# Altium project q23-harness.PrjPcb (part 2 of 2)

## Sheet PDM.SchDoc: =DocumentName
size A4; Organization: Queen's Formula SAE; Address1: 130 Stuart St, Kingston; Address2: Ontario; Address3: Canada; Address4: K7L 2V9; DocumentNumber: 1; Revision: 0; SheetNumber: 1; SheetTotal: 1
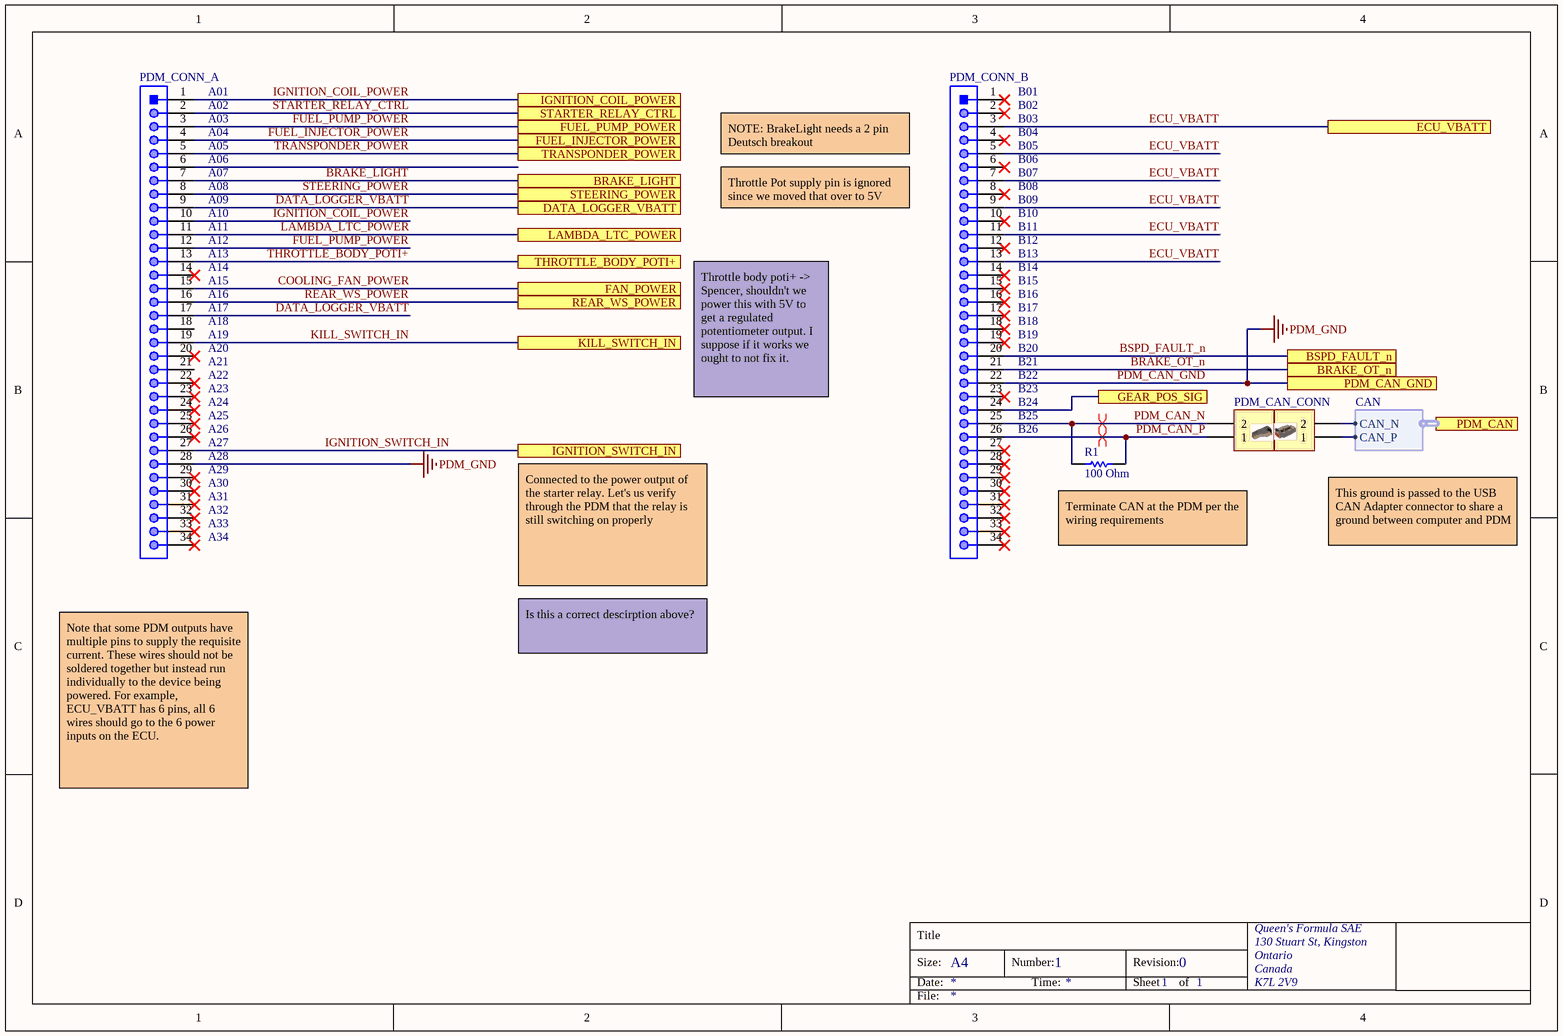
[diagram p6: PDM.SchDoc]

### Parts
(Parts that share a designator on the sheet are numbered #1, #2 ... from top to bottom, then left to right.)
PDM_CAN_CONN#1  Header 2  [HDR1X2]  (value not drawn)
PDM_CAN_CONN#2  Header 2  [HDR1X2]  (value not drawn)
PDM_CONN_A  61303411021  [61303411021]  (value not drawn)
PDM_CONN_B  61303411021  [61303411021]  (value not drawn)
R1  100 Ohm  [RESC3216X70X50NL05T20]

### Ports
BRAKE_LIGHT, BRAKE_OT_n, BSPD_FAULT_n, DATA_LOGGER_VBATT, ECU_VBATT, FAN_POWER, FUEL_INJECTOR_POWER, FUEL_PUMP_POWER, GEAR_POS_SIG, IGNITION_COIL_POWER, IGNITION_SWITCH_IN, KILL_SWITCH_IN, LAMBDA_LTC_POWER, PDM_CAN (harness CAN), PDM_CAN_GND, REAR_WS_POWER, STARTER_RELAY_CTRL, STEERING_POWER, THROTTLE_BODY_POTI+, TRANSPONDER_POWER

### Harnesses
CAN: CAN_P, CAN_N

### Nets
PDM_CAN_GND: PDM_CONN_A.28 PDM_CONN_B.22 ; port PDM_CAN_GND  [also labelled PDM_GND]  [project net FUEL_PRESSURE.SEN_0V]
BRAKE_LIGHT: PDM_CONN_A.7 ; port BRAKE_LIGHT
BRAKE_OT_n: PDM_CONN_B.21 ; port BRAKE_OT_n
BSPD_FAULT_n: PDM_CONN_B.20 ; port BSPD_FAULT_n
CAN.CAN_N: PDM_CAN_CONN#2.2 ; port PDM_CAN.CAN_N
CAN.CAN_P: PDM_CAN_CONN#2.1 ; port PDM_CAN.CAN_P
COOLING_FAN_POWER: PDM_CONN_A.15 ; port FAN_POWER
DATA_LOGGER_VBATT: PDM_CONN_A.9 PDM_CONN_A.17 ; port DATA_LOGGER_VBATT
ECU_VBATT: PDM_CONN_B.3 PDM_CONN_B.5 PDM_CONN_B.7 PDM_CONN_B.9 PDM_CONN_B.11 PDM_CONN_B.13 ; port ECU_VBATT
FUEL_INJECTOR_POWER: PDM_CONN_A.4 ; port FUEL_INJECTOR_POWER
FUEL_PUMP_POWER: PDM_CONN_A.3 PDM_CONN_A.12 ; port FUEL_PUMP_POWER
GEAR_POS_SIG: PDM_CONN_B.24 ; port GEAR_POS_SIG
IGNITION_COIL_POWER: PDM_CONN_A.1 PDM_CONN_A.10 ; port IGNITION_COIL_POWER
IGNITION_SWITCH_IN: PDM_CONN_A.27 ; port IGNITION_SWITCH_IN
KILL_SWITCH_IN: PDM_CONN_A.19 ; port KILL_SWITCH_IN
LAMBDA_LTC_POWER: PDM_CONN_A.11 ; port LAMBDA_LTC_POWER
PDM_CAN_N: PDM_CAN_CONN#1.2 PDM_CONN_B.25 R1.1
PDM_CAN_P: PDM_CAN_CONN#1.1 PDM_CONN_B.26 R1.2
REAR_WS_POWER: PDM_CONN_A.16 ; port REAR_WS_POWER
STARTER_RELAY_CTRL: PDM_CONN_A.2 ; port STARTER_RELAY_CTRL
STEERING_POWER: PDM_CONN_A.8 ; port STEERING_POWER
THROTTLE_BODY_POTI+: PDM_CONN_A.13 ; port THROTTLE_BODY_POTI+
TRANSPONDER_POWER: PDM_CONN_A.5 ; port TRANSPONDER_POWER

Not connected (* = marked no-connect by the designer): PDM_CONN_A 6 14* 18 20* 21 22* 23* 24* 25* 26* 29* 30* 31* 32* 33* 34*; PDM_CONN_B 1* 2* 4* 6* 8* 10* 12* 14* 15* 16* 17* 18* 19* 23* 27* 28* 29* 30* 31* 32* 33* 34*

### Layout directives
differential pair: PDM_CAN_N, PDM_CAN_P

### Notes on the sheet
- (near PDM_CONN_A) A01
- (near PDM_CONN_A) A02
- (near PDM_CONN_B) B01
- (near PDM_CONN_B) B02
- (near PDM_CONN_A) A03
- (near PDM_CONN_A) A04
- (near PDM_CONN_A) A05
- (near PDM_CONN_A) A06
- (near PDM_CONN_A) A07
- NOTE: BrakeLight needs a 2 pin Deutsch breakout
- (near PDM_CONN_B) B03
- (near PDM_CONN_B) B04
- (near PDM_CONN_B) B05
- (near PDM_CONN_B) B06
- (near PDM_CONN_B) B07
- (near PDM_CONN_A) A08
- (near PDM_CONN_A) A09
- (near PDM_CONN_A) A10
- (near PDM_CONN_A) A11
- (near PDM_CONN_A) A12
- Throttle Pot supply pin is ignored since we moved that over to 5V
- (near PDM_CONN_B) B08
- (near PDM_CONN_B) B09
- (near PDM_CONN_B) B10
- (near PDM_CONN_B) B11
- (near PDM_CONN_B) B12
- (near PDM_CONN_A) A13
- (near PDM_CONN_A) A14
- (near PDM_CONN_A) A15
- (near PDM_CONN_A) A16
- (near PDM_CONN_A) A17
- (near PDM_CONN_B) B13
- (near PDM_CONN_B) B14
- (near PDM_CONN_B) B15
- (near PDM_CONN_B) B16
- (near PDM_CONN_B) B17
- (near PDM_CONN_A) A18
- (near PDM_CONN_A) A19
- (near PDM_CONN_A) A20
- (near PDM_CONN_A) A21
- (near PDM_CONN_A) A22
- (near PDM_CONN_B) B18
- (near PDM_CONN_B) B19
- (near PDM_CONN_B) B20
- (near PDM_CONN_B) B21
- (near PDM_CONN_B) B22
- (near PDM_CONN_A) A23
- (near PDM_CONN_A) A24
- (near PDM_CONN_A) A25
- (near PDM_CONN_A) A26
- (near PDM_CONN_A) A27
- Throttle body poti+ -> Spencer, shouldn't we power this with 5V to get a regulated potentiometer output. I suppose if it works we ought to not fix it.
- (near PDM_CONN_B) B23
- (near PDM_CONN_B) B24
- B25
- B26
- (near PDM_CONN_A) A28
- (near PDM_CONN_A) A29
- (near PDM_CONN_A) A30
- (near PDM_CONN_A) A31
- (near PDM_CONN_A) A32
- (near PDM_CONN_A) A33
- (near PDM_CONN_A) A34
- Connected to the power output of the starter relay. Let's us verify through the PDM that the relay is still switching on properly
- (near R1) Terminate CAN at the PDM per the wiring requirements
- (near PDM_CAN_CONN#2) This ground is passed to the USB CAN Adapter connector to share a ground between computer and PDM
- Is this a correct descirption above?
- Note that some PDM outputs have multiple pins to supply the requisite current. These wires should not be soldered together but instead run individually to the device being powered. For example, ECU_VBATT has 6 pins, all 6 wires should go to the 6 power inputs on the ECU.
- Title
- Size:
- Date:
- A4
- Number:
- Time:
- Revision:
- Sheet
- of
- File:

### Library data of the parts
PDM_CAN_CONN#1 PDM_CAN_CONN#2 = Header 2: Header, 2-Pin; LatestRevisionDate: 17-Jul-2002; LatestRevisionNote: Re-released for DXP Platform.; Publisher: Altium Limited
PDM_CONN_A PDM_CONN_B = CMP-1502-01125-1: THT Angled Pin Header WR-PHD, Pitch 2.54 mm, Single Row, 34 pins; Manufacturer: Wurth Elektronik; Withstanding Voltage: 500VAC; Pin Number: 34; Rated Current: 3A; Gender: Male; Pitch: 2.54mm; Working Voltage: 250VAC; Contact Resistance: 20mOhm; Orientation: Angled; Mounting Technology: THT; Package Reference: 61303411021; Part Number: 61303411021; Datasheet URL: https://katalog.we-online.de/em/datasheet/6130xx11021.pdf; Publisher: WurthElektronik; Row Number: Single; Operating Temperature: -40to105degC; Packaging: Bag; Manufacturer URL: http://www.we-online.de
R1 = CMP-2003-00016-1: Manufacturer: Panasonic; Part Number: ERJ-8ENF1000V

## Sheet Data Logger.SchDoc: =DocumentName
size A4; Organization: Queen's Formula SAE; Address1: 130 Stuart St, Kingston; Address2: Ontario; Address3: Canada; Address4: K7L 2V9; DocumentNumber: 1; Revision: 0; SheetNumber: 1; SheetTotal: 1
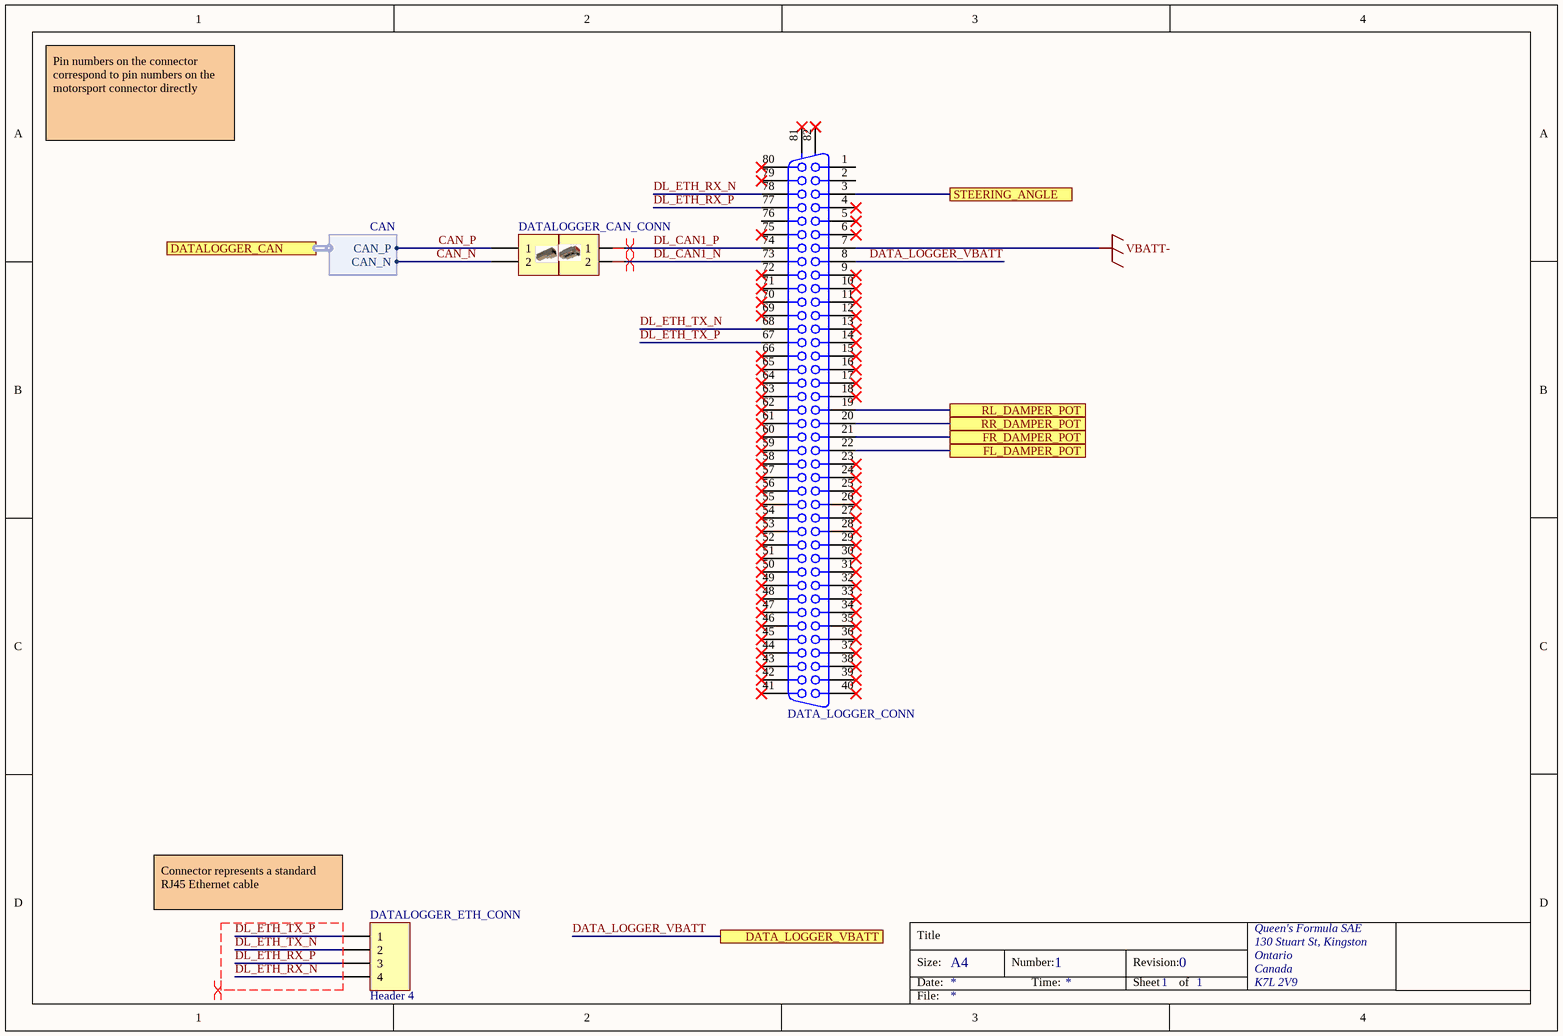
[diagram p7: Data Logger.SchDoc]

### Parts
DATA_LOGGER_CAN_CONN  Header 2  [HDR1X2]  (value not drawn)
DATA_LOGGER_CONN  Connector 80  [CHAMP1.27-2V80]  (value not drawn)
DATALOGGER_CAN_CONN  Header 2  [HDR1X2]  (value not drawn)
DATALOGGER_ETH_CONN  Header 4  [HDR1X4]

### Ports
DATA_LOGGER_VBATT, DATALOGGER_CAN (harness CAN), FL_DAMPER_POT, FR_DAMPER_POT, RL_DAMPER_POT, RR_DAMPER_POT, STEERING_ANGLE

### Harnesses
CAN: CAN_P, CAN_N

### Nets
VBATT-: DATA_LOGGER_CONN.7  [project net FUEL_PRESSURE.SEN_0V]
CAN_N: DATALOGGER_CAN_CONN.2 ; port DATALOGGER_CAN.CAN_N  [project net CAN.CAN_N]
CAN_P: DATALOGGER_CAN_CONN.1 ; port DATALOGGER_CAN.CAN_P  [project net CAN.CAN_P]
DATA_LOGGER_VBATT: DATA_LOGGER_CONN.8 ; port DATA_LOGGER_VBATT
DL_CAN1_N: DATA_LOGGER_CAN_CONN.2 DATA_LOGGER_CONN.73
DL_CAN1_P: DATA_LOGGER_CAN_CONN.1 DATA_LOGGER_CONN.74
DL_ETH_RX_N: DATA_LOGGER_CONN.78 DATALOGGER_ETH_CONN.4
DL_ETH_RX_P: DATA_LOGGER_CONN.77 DATALOGGER_ETH_CONN.3
DL_ETH_TX_N: DATA_LOGGER_CONN.68 DATALOGGER_ETH_CONN.2
DL_ETH_TX_P: DATA_LOGGER_CONN.67 DATALOGGER_ETH_CONN.1
FL_DAMPER_POT: DATA_LOGGER_CONN.22 ; port FL_DAMPER_POT
FR_DAMPER_POT: DATA_LOGGER_CONN.21 ; port FR_DAMPER_POT
RL_DAMPER_POT: DATA_LOGGER_CONN.19 ; port RL_DAMPER_POT
RR_DAMPER_POT: DATA_LOGGER_CONN.20 ; port RR_DAMPER_POT
STEERING_ANGLE: DATA_LOGGER_CONN.3 ; port STEERING_ANGLE

Not connected (* = marked no-connect by the designer): DATA_LOGGER_CONN 1 2 4* 5* 6* 9* 10* 11* 12* 13* 14* 15* 16* 17* 18* 23* 24* 25* 26* 27* 28* 29* 30* 31* 32* 33* 34* 35* 36* 37* 38* 39* 40* 41* 42* 43* 44* 45* 46* 47* 48* 49* 50* 51* 52* 53* 54* 55* 56* 57* 58* 59* 60* 61* 62* 63* 64* 65* 66* 69* 70* 71* 72* 75* 76 79* 80* 81(MH1)* 82(MH2)*

### Layout directives
differential pair: (no net found under the mark), DL_ETH_RX_N, DL_ETH_RX_P, DL_ETH_TX_N, DL_ETH_TX_P

### Notes on the sheet
- Pin numbers on the connector correspond to pin numbers on the motorsport connector directly
- (near DATALOGGER_ETH_CONN) Connector represents a standard RJ45 Ethernet cable
- Title
- Size:
- Date:
- A4
- Number:
- Time:
- Revision:
- Sheet
- of
- File:

### Library data of the parts
DATA_LOGGER_CAN_CONN DATALOGGER_CAN_CONN = Header 2: Header, 2-Pin; LatestRevisionDate: 17-Jul-2002; LatestRevisionNote: Re-released for DXP Platform.; Publisher: Altium Limited
DATA_LOGGER_CONN = Connector 80: Receptacle Header Assemby; PackageDocument: C; Positions: 80; Published: 15-Jun-2001; LatestRevisionDate: 17-Jul-2002; LatestRevisionNote: Re-released for DXP Platform.; DatasheetDocument: 1-Oct-1983; PackageReference: 917334; Publisher: Altium Limited; Orientation: Vertical
DATALOGGER_ETH_CONN = Header 4: Header, 4-Pin; LatestRevisionDate: 17-Jul-2002; LatestRevisionNote: Re-released for DXP Platform.; Publisher: Altium Limited

## Sheet REAR_LOOM_BULKHEAD.SchDoc: =DocumentName
size 420 x 297 mm; Organization: Queen's Formula SAE; Address1: 130 Stuart St, Kingston; Address2: Ontario; Address3: Canada; Address4: K7L 2V9; DocumentNumber: 1; Revision: 0; SheetNumber: 1; SheetTotal: 1
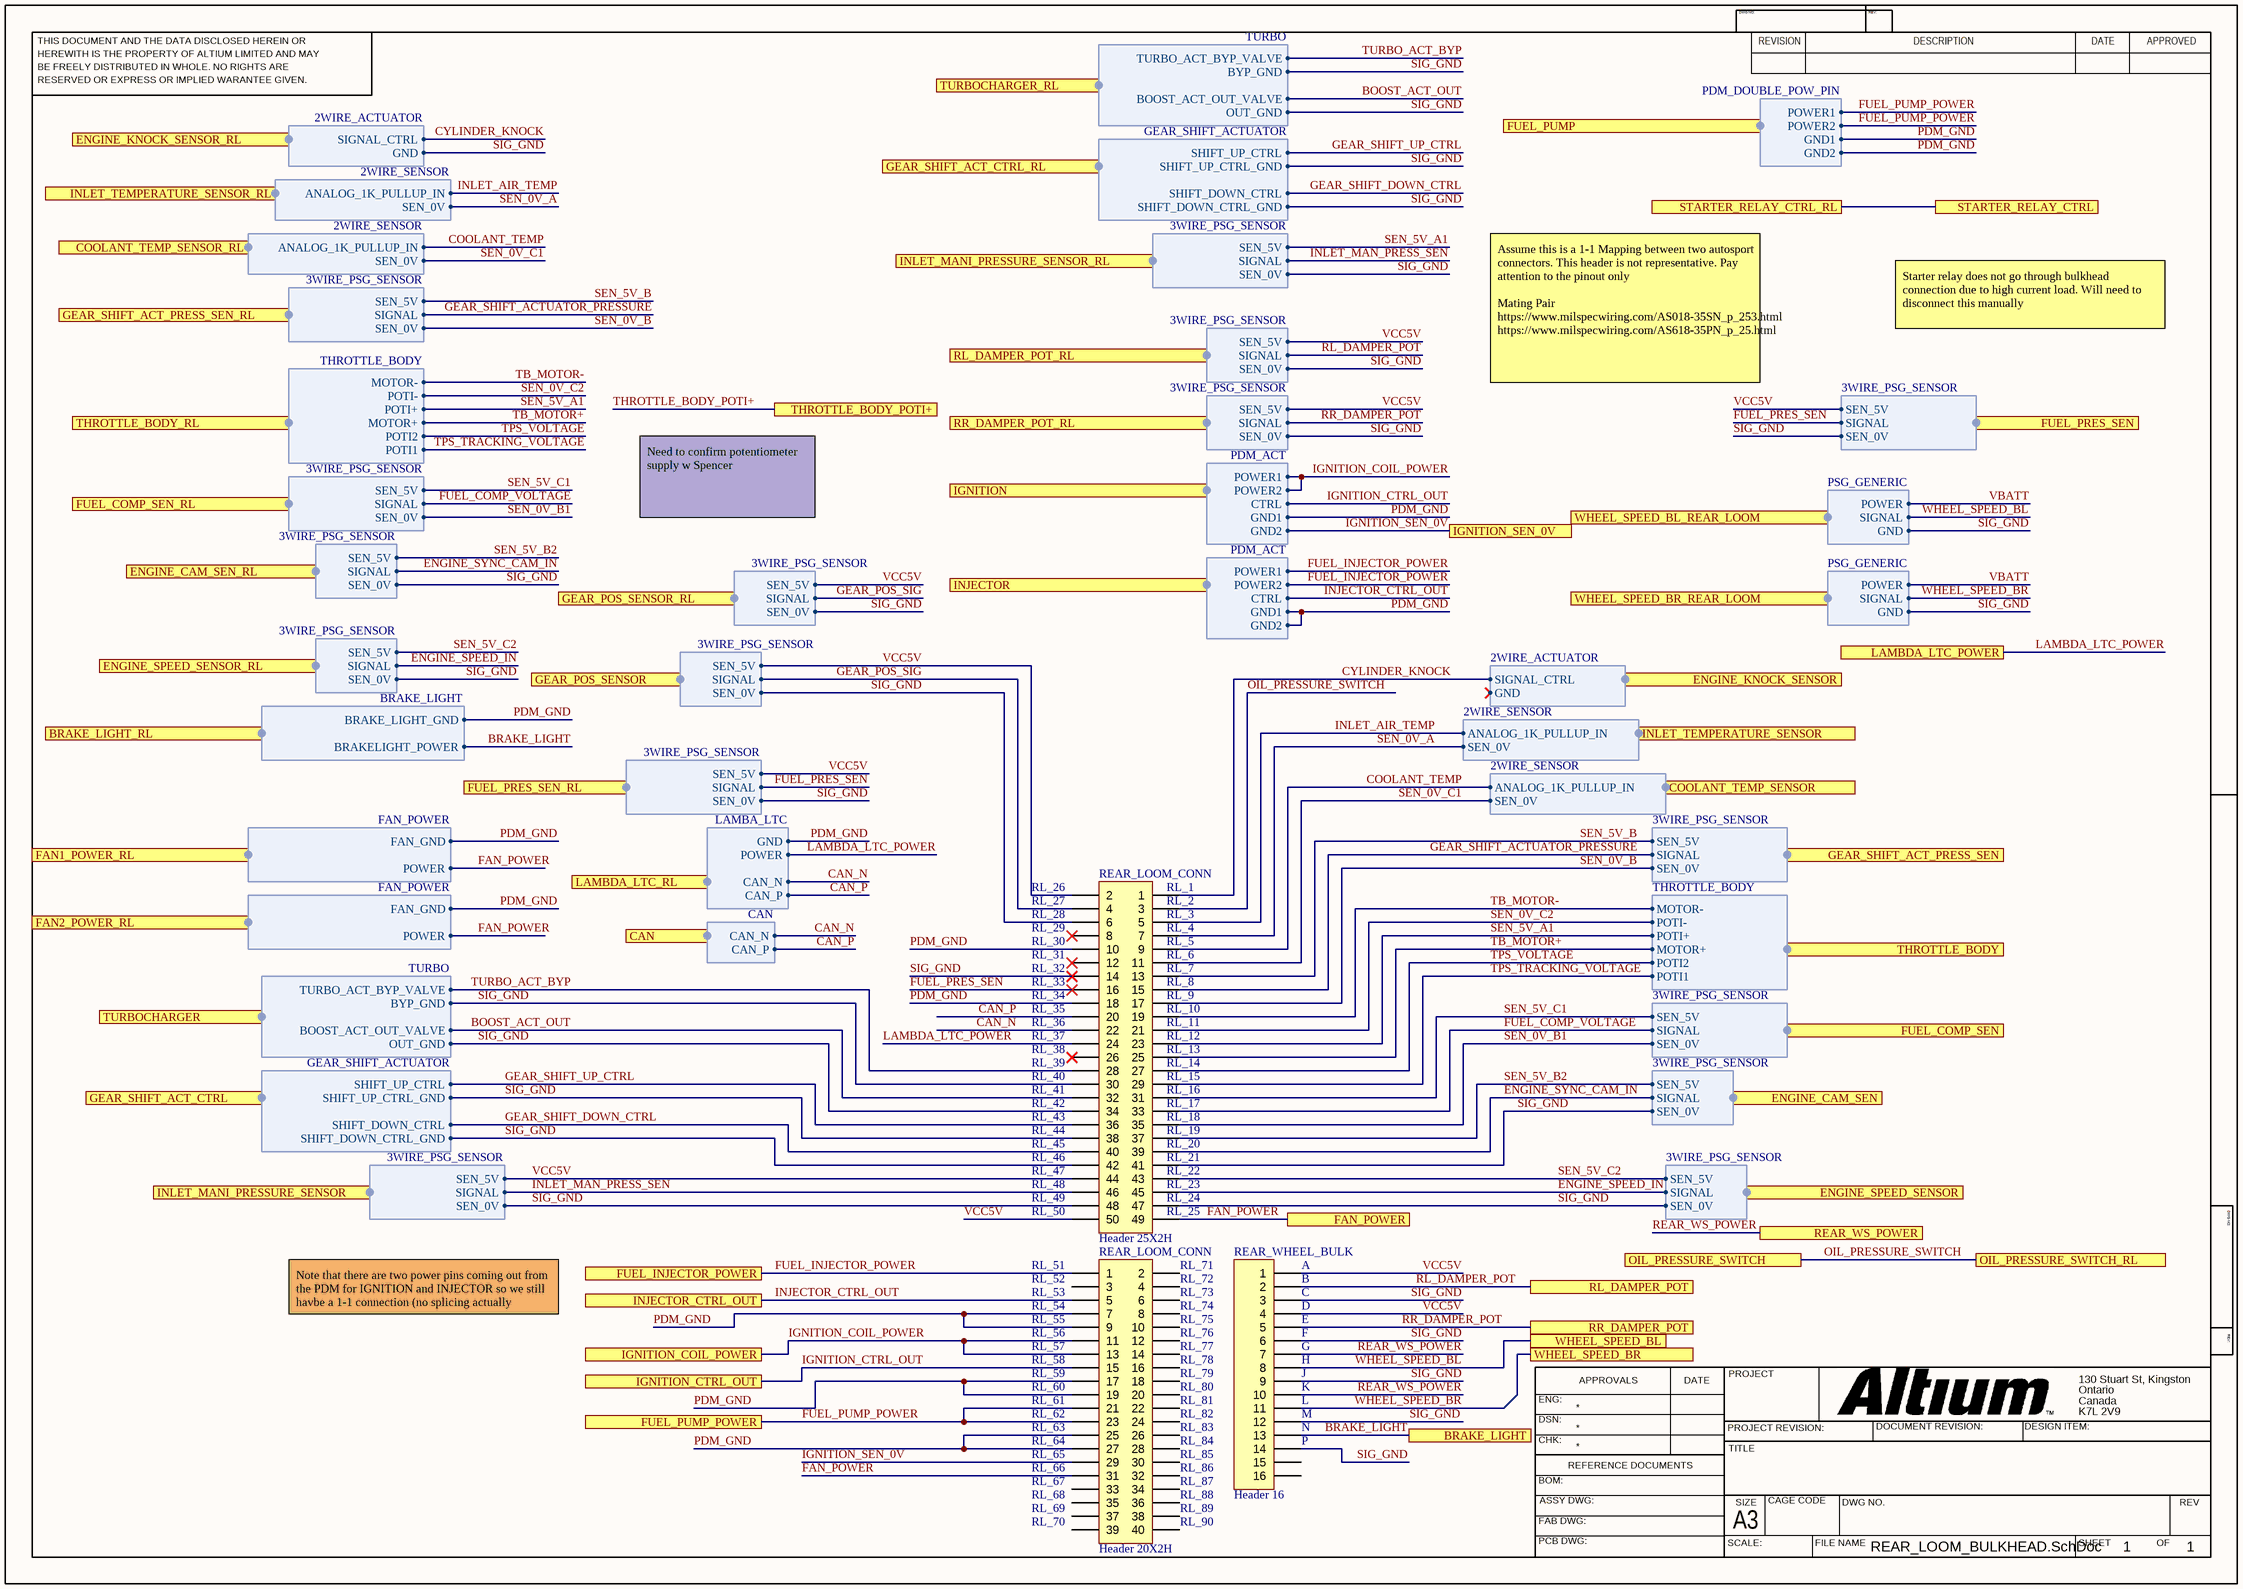
[diagram p8: REAR_LOOM_BULKHEAD.SchDoc]

### Parts
(Parts that share a designator on the sheet are numbered #1, #2 ... from top to bottom, then left to right.)
REAR_LOOM_CONN#1  Header 25X2H  [HDR2X25H]
REAR_LOOM_CONN#2  Header 20X2H  [HDR2X20H]
REAR_WHEEL_BULK  Header 16  [HDR1X16]

### Ports
BRAKE_LIGHT, BRAKE_LIGHT_RL (harness BRAKE_LIGHT), CAN (harness CAN), COOLANT_TEMP_SENSOR (harness 2WIRE_SENSOR), COOLANT_TEMP_SENSOR_RL (harness 2WIRE_SENSOR), ENGINE_CAM_SEN (harness 3WIRE_PSG_SENSOR), ENGINE_CAM_SEN_RL (harness 3WIRE_PSG_SENSOR), ENGINE_KNOCK_SENSOR (harness 2WIRE_ACTUATOR), ENGINE_KNOCK_SENSOR_RL (harness 2WIRE_ACTUATOR), ENGINE_SPEED_SENSOR (harness 3WIRE_PSG_SENSOR), ENGINE_SPEED_SENSOR_RL (harness 3WIRE_PSG_SENSOR), FAN1_POWER_RL (harness FAN_POWER), FAN2_POWER_RL (harness FAN_POWER), FAN_POWER, FUEL_COMP_SEN (harness 3WIRE_PSG_SENSOR), FUEL_COMP_SEN_RL (harness 3WIRE_PSG_SENSOR), FUEL_INJECTOR_POWER, FUEL_PRES_SEN (harness 3WIRE_PSG_SENSOR), FUEL_PRES_SEN_RL (harness 3WIRE_PSG_SENSOR), FUEL_PUMP (harness PDM_DOUBLE_POW_PIN), FUEL_PUMP_POWER, GEAR_POS_SENSOR (harness 3WIRE_PSG_SENSOR), GEAR_POS_SENSOR_RL (harness 3WIRE_PSG_SENSOR), GEAR_SHIFT_ACT_CTRL (harness GEAR_SHIFT_ACTUATOR), GEAR_SHIFT_ACT_CTRL_RL (harness GEAR_SHIFT_ACTUATOR), GEAR_SHIFT_ACT_PRESS_SEN (harness 3WIRE_PSG_SENSOR), GEAR_SHIFT_ACT_PRESS_SEN_RL (harness 3WIRE_PSG_SENSOR), IGNITION (harness PDM_ACT), IGNITION_COIL_POWER, IGNITION_CTRL_OUT, IGNITION_SEN_0V, INJECTOR (harness PDM_ACT), INJECTOR_CTRL_OUT, INLET_MANI_PRESSURE_SENSOR (harness 3WIRE_PSG_SENSOR), INLET_MANI_PRESSURE_SENSOR_RL (harness 3WIRE_PSG_SENSOR), INLET_TEMPERATURE_SENSOR (harness 2WIRE_SENSOR), INLET_TEMPERATURE_SENSOR_RL (harness 2WIRE_SENSOR), LAMBDA_LTC_POWER, LAMBDA_LTC_RL (harness LAMBA_LTC), OIL_PRESSURE_SWITCH, OIL_PRESSURE_SWITCH_RL, REAR_WS_POWER, RL_DAMPER_POT, RL_DAMPER_POT_RL (harness 3WIRE_PSG_SENSOR), RR_DAMPER_POT, RR_DAMPER_POT_RL (harness 3WIRE_PSG_SENSOR), STARTER_RELAY_CTRL, STARTER_RELAY_CTRL_RL, THROTTLE_BODY (harness THROTTLE_BODY), THROTTLE_BODY_POTI+, THROTTLE_BODY_RL (harness THROTTLE_BODY), TURBOCHARGER (harness TURBO), TURBOCHARGER_RL (harness TURBO), WHEEL_SPEED_BL, WHEEL_SPEED_BL_REAR_LOOM (harness PSG_GENERIC), WHEEL_SPEED_BR, WHEEL_SPEED_BR_REAR_LOOM (harness PSG_GENERIC)

### Harnesses
2WIRE_ACTUATOR: SIGNAL_CTRL, GND
GEAR_SHIFT_ACTUATOR: SHIFT_UP_CTRL, SHIFT_DOWN_CTRL, SHIFT_UP_CTRL_GND, SHIFT_DOWN_CTRL_GND
3WIRE_PSG_SENSOR: SEN_5V, SEN_0V, SIGNAL
TURBO: TURBO_ACT_BYP_VALVE, BOOST_ACT_OUT_VALVE, BYP_GND, OUT_GND
2WIRE_SENSOR: ANALOG_1K_PULLUP_IN, SEN_0V
THROTTLE_BODY: MOTOR+, MOTOR-, POTI1, POTI2, POTI-, POTI+
BRAKE_LIGHT: BRAKELIGHT_POWER, BRAKE_LIGHT_GND
PDM_ACT: POWER1, CTRL, GND1, GND2, POWER2
PDM_DOUBLE_POW_PIN: POWER1, GND1, GND2, POWER2
PSG_GENERIC: POWER, GND, SIGNAL
FAN_POWER: POWER, FAN_GND
CAN: CAN_P, CAN_N
LAMBA_LTC: CAN_P, CAN_N, POWER, GND

### Nets
SEN_5V_A1: REAR_LOOM_CONN#1.2 REAR_LOOM_CONN#1.23 REAR_LOOM_CONN#1.44 REAR_LOOM_CONN#1.50 REAR_WHEEL_BULK.1 REAR_WHEEL_BULK.4 ; port INLET_MANI_PRESSURE_SENSOR.SEN_5V, port THROTTLE_BODY.POTI+, port THROTTLE_BODY_RL.POTI+, port INLET_MANI_PRESSURE_SENSOR_RL.SEN_5V, port RL_DAMPER_POT_RL.SEN_5V, port RR_DAMPER_POT_RL.SEN_5V, port GEAR_POS_SENSOR.SEN_5V, port GEAR_POS_SENSOR_RL.SEN_5V, port FUEL_PRES_SEN.SEN_5V, port FUEL_PRES_SEN_RL.SEN_5V  [also labelled VCC5V]  [project net FUEL_PRESSURE.SEN_5V]
SIG_GND: REAR_LOOM_CONN#1.6 REAR_LOOM_CONN#1.14 REAR_LOOM_CONN#1.30 REAR_LOOM_CONN#1.34 REAR_LOOM_CONN#1.38 REAR_LOOM_CONN#1.41 REAR_LOOM_CONN#1.42 REAR_LOOM_CONN#1.47 REAR_LOOM_CONN#1.48 REAR_WHEEL_BULK.3 REAR_WHEEL_BULK.6 REAR_WHEEL_BULK.9 REAR_WHEEL_BULK.12 REAR_WHEEL_BULK.14 ; port ENGINE_KNOCK_SENSOR.GND, port GEAR_SHIFT_ACT_CTRL.SHIFT_UP_CTRL_GND, port GEAR_SHIFT_ACT_CTRL.SHIFT_DOWN_CTRL_GND, port ENGINE_SPEED_SENSOR.SEN_0V, port ENGINE_CAM_SEN.SEN_0V, port INLET_MANI_PRESSURE_SENSOR.SEN_0V, port TURBOCHARGER.BYP_GND, port TURBOCHARGER.OUT_GND, port ENGINE_KNOCK_SENSOR_RL.GND, port ENGINE_SPEED_SENSOR_RL.SEN_0V, port ENGINE_CAM_SEN_RL.SEN_0V, port GEAR_SHIFT_ACT_CTRL_RL.SHIFT_UP_CTRL_GND, port GEAR_SHIFT_ACT_CTRL_RL.SHIFT_DOWN_CTRL_GND, port INLET_MANI_PRESSURE_SENSOR_RL.SEN_0V, port TURBOCHARGER_RL.BYP_GND, port TURBOCHARGER_RL.OUT_GND, port RL_DAMPER_POT_RL.SEN_0V, port RR_DAMPER_POT_RL.SEN_0V, port WHEEL_SPEED_BL_REAR_LOOM.GND, port WHEEL_SPEED_BR_REAR_LOOM.GND, port GEAR_POS_SENSOR.SEN_0V, port GEAR_POS_SENSOR_RL.SEN_0V, port FUEL_PRES_SEN.SEN_0V, port FUEL_PRES_SEN_RL.SEN_0V  [project net FUEL_PRESSURE.SEN_0V]
BOOST_ACT_OUT: REAR_LOOM_CONN#1.32 ; port TURBOCHARGER.BOOST_ACT_OUT_VALVE, port TURBOCHARGER_RL.BOOST_ACT_OUT_VALVE
BRAKE_LIGHT: REAR_WHEEL_BULK.13 ; port BRAKE_LIGHT, port BRAKE_LIGHT_RL.BRAKELIGHT_POWER
CAN_N: REAR_LOOM_CONN#1.22 ; port CAN.CAN_N, port LAMBDA_LTC_RL.CAN_N  [project net CAN.CAN_N]
CAN_P: REAR_LOOM_CONN#1.20 ; port CAN.CAN_P, port LAMBDA_LTC_RL.CAN_P  [project net CAN.CAN_P]
COOLANT_TEMP: REAR_LOOM_CONN#1.9 ; port COOLANT_TEMP_SENSOR.ANALOG_1K_PULLUP_IN, port COOLANT_TEMP_SENSOR_RL.ANALOG_1K_PULLUP_IN
CYLINDER_KNOCK: REAR_LOOM_CONN#1.1 ; port ENGINE_KNOCK_SENSOR.SIGNAL_CTRL, port ENGINE_KNOCK_SENSOR_RL.SIGNAL_CTRL
ENGINE_SPEED_IN: REAR_LOOM_CONN#1.45 ; port ENGINE_SPEED_SENSOR.SIGNAL, port ENGINE_SPEED_SENSOR_RL.SIGNAL
ENGINE_SYNC_CAM_IN: REAR_LOOM_CONN#1.39 ; port ENGINE_CAM_SEN.SIGNAL, port ENGINE_CAM_SEN_RL.SIGNAL
FAN_POWER: REAR_LOOM_CONN#1.49 REAR_LOOM_CONN#2.31 ; port FAN_POWER, port FAN1_POWER_RL.POWER, port FAN2_POWER_RL.POWER  [project net COOLING_FAN_POWER]
FUEL_COMP_VOLTAGE: REAR_LOOM_CONN#1.33 ; port FUEL_COMP_SEN.SIGNAL, port FUEL_COMP_SEN_RL.SIGNAL
FUEL_INJECTOR_POWER: REAR_LOOM_CONN#2.1 ; port FUEL_INJECTOR_POWER, port INJECTOR.POWER1, port INJECTOR.POWER2
FUEL_PRES_SEN: REAR_LOOM_CONN#1.16 ; port FUEL_PRES_SEN.SIGNAL, port FUEL_PRES_SEN_RL.SIGNAL
FUEL_PUMP_POWER: REAR_LOOM_CONN#2.21 REAR_LOOM_CONN#2.23 ; port FUEL_PUMP_POWER, port FUEL_PUMP.POWER1, port FUEL_PUMP.POWER2
GEAR_POS_SIG: REAR_LOOM_CONN#1.4 ; port GEAR_POS_SENSOR.SIGNAL, port GEAR_POS_SENSOR_RL.SIGNAL
GEAR_SHIFT_ACTUATOR_PRESSURE: REAR_LOOM_CONN#1.15 ; port GEAR_SHIFT_ACT_PRESS_SEN.SIGNAL, port GEAR_SHIFT_ACT_PRESS_SEN_RL.SIGNAL
GEAR_SHIFT_DOWN_CTRL: REAR_LOOM_CONN#1.40 ; port GEAR_SHIFT_ACT_CTRL.SHIFT_DOWN_CTRL, port GEAR_SHIFT_ACT_CTRL_RL.SHIFT_DOWN_CTRL
GEAR_SHIFT_UP_CTRL: REAR_LOOM_CONN#1.36 ; port GEAR_SHIFT_ACT_CTRL.SHIFT_UP_CTRL, port GEAR_SHIFT_ACT_CTRL_RL.SHIFT_UP_CTRL
IGNITION_COIL_POWER: REAR_LOOM_CONN#2.11 REAR_LOOM_CONN#2.13 ; port IGNITION_COIL_POWER, port IGNITION.POWER1, port IGNITION.POWER2
IGNITION_CTRL_OUT: REAR_LOOM_CONN#2.15 ; port IGNITION_CTRL_OUT, port IGNITION.CTRL
IGNITION_SEN_0V: REAR_LOOM_CONN#1.17 REAR_LOOM_CONN#2.29 ; port IGNITION_SEN_0V, port GEAR_SHIFT_ACT_PRESS_SEN.SEN_0V, port GEAR_SHIFT_ACT_PRESS_SEN_RL.SEN_0V, port IGNITION.GND2  [also labelled SEN_0V_B]
INJECTOR_CTRL_OUT: REAR_LOOM_CONN#2.5 ; port INJECTOR_CTRL_OUT, port INJECTOR.CTRL
INLET_AIR_TEMP: REAR_LOOM_CONN#1.5 ; port INLET_TEMPERATURE_SENSOR.ANALOG_1K_PULLUP_IN, port INLET_TEMPERATURE_SENSOR_RL.ANALOG_1K_PULLUP_IN
INLET_MAN_PRESS_SEN: REAR_LOOM_CONN#1.46 ; port INLET_MANI_PRESSURE_SENSOR.SIGNAL, port INLET_MANI_PRESSURE_SENSOR_RL.SIGNAL
LAMBDA_LTC_POWER: REAR_LOOM_CONN#1.24 ; port LAMBDA_LTC_POWER, port LAMBDA_LTC_RL.POWER
OIL_PRESSURE_SWITCH: REAR_LOOM_CONN#1.3 ; port OIL_PRESSURE_SWITCH, port OIL_PRESSURE_SWITCH_RL
PDM_GND: REAR_LOOM_CONN#1.10 REAR_LOOM_CONN#1.18 REAR_LOOM_CONN#2.7 REAR_LOOM_CONN#2.9 REAR_LOOM_CONN#2.17 REAR_LOOM_CONN#2.19 REAR_LOOM_CONN#2.25 REAR_LOOM_CONN#2.27 ; port BRAKE_LIGHT_RL.BRAKE_LIGHT_GND, port INJECTOR.GND1, port INJECTOR.GND2, port IGNITION.GND1, port FUEL_PUMP.GND1, port FUEL_PUMP.GND2, port FAN1_POWER_RL.FAN_GND, port FAN2_POWER_RL.FAN_GND, port LAMBDA_LTC_RL.GND
REAR_WS_POWER: REAR_WHEEL_BULK.7 REAR_WHEEL_BULK.10 ; port REAR_WS_POWER
RL_DAMPER_POT: REAR_WHEEL_BULK.2 ; port RL_DAMPER_POT, port RL_DAMPER_POT_RL.SIGNAL
RR_DAMPER_POT: REAR_WHEEL_BULK.5 ; port RR_DAMPER_POT, port RR_DAMPER_POT_RL.SIGNAL
SEN_0V_A: REAR_LOOM_CONN#1.7 ; port INLET_TEMPERATURE_SENSOR.SEN_0V, port INLET_TEMPERATURE_SENSOR_RL.SEN_0V
SEN_0V_B1: REAR_LOOM_CONN#1.35 ; port FUEL_COMP_SEN.SEN_0V, port FUEL_COMP_SEN_RL.SEN_0V
SEN_0V_C1: REAR_LOOM_CONN#1.11 ; port COOLANT_TEMP_SENSOR.SEN_0V, port COOLANT_TEMP_SENSOR_RL.SEN_0V
SEN_0V_C2: REAR_LOOM_CONN#1.21 ; port THROTTLE_BODY.POTI-, port THROTTLE_BODY_RL.POTI-
SEN_5V_B: REAR_LOOM_CONN#1.13 ; port GEAR_SHIFT_ACT_PRESS_SEN.SEN_5V, port GEAR_SHIFT_ACT_PRESS_SEN_RL.SEN_5V
SEN_5V_B2: REAR_LOOM_CONN#1.37 ; port ENGINE_CAM_SEN.SEN_5V, port ENGINE_CAM_SEN_RL.SEN_5V
SEN_5V_C1: REAR_LOOM_CONN#1.31 ; port FUEL_COMP_SEN.SEN_5V, port FUEL_COMP_SEN_RL.SEN_5V
SEN_5V_C2: REAR_LOOM_CONN#1.43 ; port ENGINE_SPEED_SENSOR.SEN_5V, port ENGINE_SPEED_SENSOR_RL.SEN_5V
STARTER_RELAY_CTRL: port STARTER_RELAY_CTRL, port STARTER_RELAY_CTRL_RL
TB_MOTOR+: REAR_LOOM_CONN#1.25 ; port THROTTLE_BODY.MOTOR+, port THROTTLE_BODY_RL.MOTOR+
TB_MOTOR-: REAR_LOOM_CONN#1.19 ; port THROTTLE_BODY.MOTOR-, port THROTTLE_BODY_RL.MOTOR-
TPS_TRACKING_VOLTAGE: REAR_LOOM_CONN#1.29 ; port THROTTLE_BODY.POTI1, port THROTTLE_BODY_RL.POTI1
TPS_VOLTAGE: REAR_LOOM_CONN#1.27 ; port THROTTLE_BODY.POTI2, port THROTTLE_BODY_RL.POTI2
TURBO_ACT_BYP: REAR_LOOM_CONN#1.28 ; port TURBOCHARGER.TURBO_ACT_BYP_VALVE, port TURBOCHARGER_RL.TURBO_ACT_BYP_VALVE
VBATT: port WHEEL_SPEED_BL_REAR_LOOM.POWER, port WHEEL_SPEED_BR_REAR_LOOM.POWER
WHEEL_SPEED_BL: REAR_WHEEL_BULK.8 ; port WHEEL_SPEED_BL, port WHEEL_SPEED_BL_REAR_LOOM.SIGNAL
WHEEL_SPEED_BR: REAR_WHEEL_BULK.11 ; port WHEEL_SPEED_BR, port WHEEL_SPEED_BR_REAR_LOOM.SIGNAL

Not connected (* = marked no-connect by the designer): REAR_LOOM_CONN#1 8* 12* 26*; REAR_LOOM_CONN#2 2 3 4 6 8 10 12 14 16 18 20 22 24 26 28 30 32 33 34 35 36 37 38 39 40; REAR_WHEEL_BULK 15 16

### Notes on the sheet
- Starter relay does not go through bulkhead connection due to high current load. Will need to disconnect this manually
- Assume this is a 1-1 Mapping between two autosport connectors. This header is not representative. Pay attention to the pinout only
  Mating Pair
  https://www.milspecwiring.com/AS018-35SN_p_253.html
  https://www.milspecwiring.com/AS618-35PN_p_25.html
- Need to confirm potentiometer supply w Spencer
- (near REAR_LOOM_CONN#1) RL_26
- (near REAR_LOOM_CONN#1) RL_27
- (near REAR_LOOM_CONN#1) RL_28
- (near REAR_LOOM_CONN#1) RL_29
- (near REAR_LOOM_CONN#1) RL_1
- (near REAR_LOOM_CONN#1) RL_2
- (near REAR_LOOM_CONN#1) RL_3
- (near REAR_LOOM_CONN#1) RL_4
- (near REAR_LOOM_CONN#1) RL_30
- (near REAR_LOOM_CONN#1) RL_31
- (near REAR_LOOM_CONN#1) RL_32
- (near REAR_LOOM_CONN#1) RL_33
- (near REAR_LOOM_CONN#1) RL_34
- (near REAR_LOOM_CONN#1) RL_5
- (near REAR_LOOM_CONN#1) RL_6
- (near REAR_LOOM_CONN#1) RL_7
- (near REAR_LOOM_CONN#1) RL_8
- (near REAR_LOOM_CONN#1) RL_9
- (near REAR_LOOM_CONN#1) RL_35
- (near REAR_LOOM_CONN#1) RL_36
- (near REAR_LOOM_CONN#1) RL_37
- (near REAR_LOOM_CONN#1) RL_38
- (near REAR_LOOM_CONN#1) RL_39
- (near REAR_LOOM_CONN#1) RL_10
- (near REAR_LOOM_CONN#1) RL_11
- (near REAR_LOOM_CONN#1) RL_12
- (near REAR_LOOM_CONN#1) RL_13
- (near REAR_LOOM_CONN#1) RL_14
- (near REAR_LOOM_CONN#1) RL_40
- (near REAR_LOOM_CONN#1) RL_41
- (near REAR_LOOM_CONN#1) RL_42
- (near REAR_LOOM_CONN#1) RL_43
- (near REAR_LOOM_CONN#1) RL_44
- (near REAR_LOOM_CONN#1) RL_15
- (near REAR_LOOM_CONN#1) RL_16
- (near REAR_LOOM_CONN#1) RL_17
- (near REAR_LOOM_CONN#1) RL_18
- (near REAR_LOOM_CONN#1) RL_19
- (near REAR_LOOM_CONN#1) RL_45
- (near REAR_LOOM_CONN#1) RL_46
- (near REAR_LOOM_CONN#1) RL_47
- (near REAR_LOOM_CONN#1) RL_48
- (near REAR_LOOM_CONN#1) RL_49
- (near REAR_LOOM_CONN#1) RL_20
- (near REAR_LOOM_CONN#1) RL_21
- (near REAR_LOOM_CONN#1) RL_22
- (near REAR_LOOM_CONN#1) RL_23
- (near REAR_LOOM_CONN#1) RL_24
- (near REAR_LOOM_CONN#1) RL_50
- (near REAR_LOOM_CONN#2) RL_51
- (near REAR_LOOM_CONN#1) RL_25
- (near REAR_LOOM_CONN#2) RL_71
- (near REAR_WHEEL_BULK) A
- Note that there are two power pins coming out from the PDM for IGNITION and INJECTOR so we still havbe a 1-1 connection (no splicing actually needed)
- (near REAR_LOOM_CONN#2) RL_52
- (near REAR_LOOM_CONN#2) RL_53
- (near REAR_LOOM_CONN#2) RL_54
- (near REAR_LOOM_CONN#2) RL_55
- (near REAR_LOOM_CONN#2) RL_56
- (near REAR_LOOM_CONN#2) RL_72
- (near REAR_LOOM_CONN#2) RL_73
- (near REAR_LOOM_CONN#2) RL_74
- (near REAR_LOOM_CONN#2) RL_75
- (near REAR_LOOM_CONN#2) RL_76
- (near REAR_WHEEL_BULK) B
- (near REAR_WHEEL_BULK) C
- (near REAR_WHEEL_BULK) D
- (near REAR_WHEEL_BULK) E
- (near REAR_WHEEL_BULK) F
- (near REAR_LOOM_CONN#2) RL_57
- (near REAR_LOOM_CONN#2) RL_58
- (near REAR_LOOM_CONN#2) RL_59
- (near REAR_LOOM_CONN#2) RL_60
- (near REAR_LOOM_CONN#2) RL_61
- (near REAR_LOOM_CONN#2) RL_77
- (near REAR_LOOM_CONN#2) RL_78
- (near REAR_LOOM_CONN#2) RL_79
- (near REAR_LOOM_CONN#2) RL_80
- (near REAR_LOOM_CONN#2) RL_81
- (near REAR_WHEEL_BULK) G
- (near REAR_WHEEL_BULK) H
- (near REAR_WHEEL_BULK) J
- (near REAR_WHEEL_BULK) K
- (near REAR_WHEEL_BULK) L
- (near REAR_LOOM_CONN#2) RL_62
- (near REAR_LOOM_CONN#2) RL_63
- (near REAR_LOOM_CONN#2) RL_64
- (near REAR_LOOM_CONN#2) RL_65
- (near REAR_LOOM_CONN#2) RL_66
- (near REAR_LOOM_CONN#2) RL_82
- (near REAR_LOOM_CONN#2) RL_83
- (near REAR_LOOM_CONN#2) RL_84
- (near REAR_LOOM_CONN#2) RL_85
- (near REAR_LOOM_CONN#2) RL_86
- (near REAR_WHEEL_BULK) M
- (near REAR_WHEEL_BULK) N
- (near REAR_WHEEL_BULK) P
- (near REAR_LOOM_CONN#2) RL_67
- (near REAR_LOOM_CONN#2) RL_68
- (near REAR_LOOM_CONN#2) RL_69
- (near REAR_LOOM_CONN#2) RL_70
- (near REAR_LOOM_CONN#2) RL_87
- (near REAR_LOOM_CONN#2) RL_88
- (near REAR_LOOM_CONN#2) RL_89
- (near REAR_LOOM_CONN#2) RL_90
- THIS DOCUMENT AND THE DATA DISCLOSED HEREIN OR
- HEREWITH IS THE PROPERTY OF ALTIUM LIMITED AND MAY
- DWG NO:
- REVISION
- REV:
- DESCRIPTION
- DATE
- APPROVED
- BE FREELY DISTRIBUTED IN WHOLE. NO RIGHTS ARE
- RESERVED OR EXPRESS OR IMPLIED WARANTEE GIVEN.
- ENG:
- APPROVALS
- PROJECT
- DSN:
- CHK:
- REFERENCE DOCUMENTS
- PROJECT REVISION:
- TITLE
- DOCUMENT REVISION:
- DESIGN ITEM:
- BOM:
- FAB DWG:
- PCB DWG:
- ASSY DWG:
- SCALE:
- A3
- SIZE
- CAGE CODE
- FILE NAME
- DWG NO.
- SHEET
- OF
- REV

### Library data of the parts
REAR_LOOM_CONN#1 = Header 25X2H: Header, 25-Pin, Dual row, Right Angle; LatestRevisionDate: 17-Jul-2002; LatestRevisionNote: Re-released for DXP Platform.; Publisher: Altium Limited
REAR_LOOM_CONN#2 = Header 20X2H: Header, 20-Pin, Dual row, Right Angle; LatestRevisionDate: 17-Jul-2002; LatestRevisionNote: Re-released for DXP Platform.; Publisher: Altium Limited
REAR_WHEEL_BULK = Header 16: Header, 16-Pin; LatestRevisionDate: 17-Jul-2002; LatestRevisionNote: Re-released for DXP Platform.; Publisher: Altium Limited

## Sheet PEDALBOX_BULKHEAD.SchDoc: =DocumentName
size A4; Organization: Queen's Formula SAE; Address1: 130 Stuart St, Kingston; Address2: Ontario; Address3: Canada; Address4: K7L 2V9; DocumentNumber: 1; Revision: 0; SheetNumber: 1; SheetTotal: 1
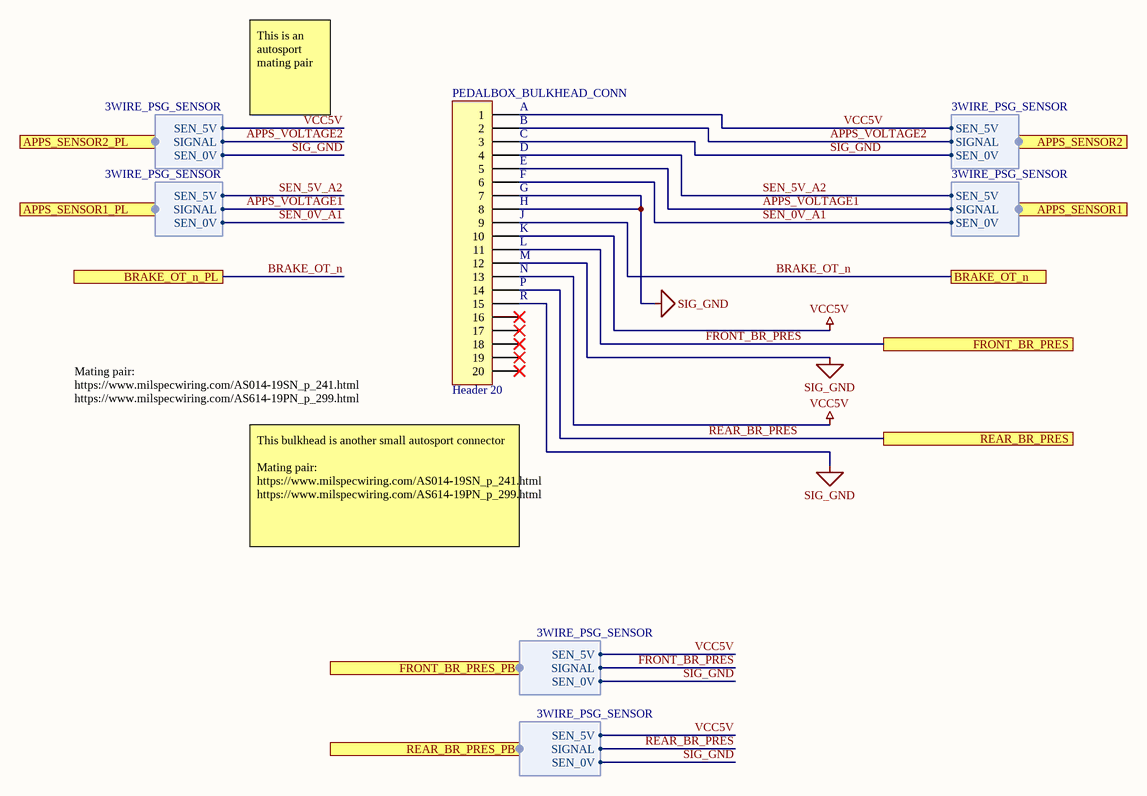
[diagram p9: PEDALBOX_BULKHEAD.SchDoc]

### Parts
PEDALBOX_BULKHEAD_CONN  Header 20  [HDR1X20]

### Ports
APPS_SENSOR1 (harness 3WIRE_PSG_SENSOR), APPS_SENSOR1_PL (harness 3WIRE_PSG_SENSOR), APPS_SENSOR2 (harness 3WIRE_PSG_SENSOR), APPS_SENSOR2_PL (harness 3WIRE_PSG_SENSOR), BRAKE_OT_n, BRAKE_OT_n_PL, FRONT_BR_PRES, FRONT_BR_PRES_PB (harness 3WIRE_PSG_SENSOR), REAR_BR_PRES, REAR_BR_PRES_PB (harness 3WIRE_PSG_SENSOR)

### Harnesses
3WIRE_PSG_SENSOR: SEN_5V, SEN_0V, SIGNAL

### Nets
SIG_GND: PEDALBOX_BULKHEAD_CONN.3 PEDALBOX_BULKHEAD_CONN.7 PEDALBOX_BULKHEAD_CONN.8 PEDALBOX_BULKHEAD_CONN.12 PEDALBOX_BULKHEAD_CONN.15 ; port APPS_SENSOR2.SEN_0V, port APPS_SENSOR2_PL.SEN_0V, port FRONT_BR_PRES_PB.SEN_0V, port REAR_BR_PRES_PB.SEN_0V  [project net FUEL_PRESSURE.SEN_0V]
VCC5V: PEDALBOX_BULKHEAD_CONN.1 PEDALBOX_BULKHEAD_CONN.10 PEDALBOX_BULKHEAD_CONN.13 ; port APPS_SENSOR2.SEN_5V, port APPS_SENSOR2_PL.SEN_5V, port FRONT_BR_PRES_PB.SEN_5V, port REAR_BR_PRES_PB.SEN_5V  [project net FUEL_PRESSURE.SEN_5V]
APPS_VOLTAGE1: PEDALBOX_BULKHEAD_CONN.5 ; port APPS_SENSOR1.SIGNAL, port APPS_SENSOR1_PL.SIGNAL  [project net APPS1_VOLTAGE]
APPS_VOLTAGE2: PEDALBOX_BULKHEAD_CONN.2 ; port APPS_SENSOR2.SIGNAL, port APPS_SENSOR2_PL.SIGNAL  [project net APPS2_VOLTAGE]
BRAKE_OT_n: PEDALBOX_BULKHEAD_CONN.9 ; port BRAKE_OT_n, port BRAKE_OT_n_PL
FRONT_BR_PRES: PEDALBOX_BULKHEAD_CONN.11 ; port FRONT_BR_PRES, port FRONT_BR_PRES_PB.SIGNAL  [project net BSPD_BRAKE_SEN]
REAR_BR_PRES: PEDALBOX_BULKHEAD_CONN.14 ; port REAR_BR_PRES, port REAR_BR_PRES_PB.SIGNAL
SEN_0V_A1: PEDALBOX_BULKHEAD_CONN.6 ; port APPS_SENSOR1.SEN_0V, port APPS_SENSOR1_PL.SEN_0V
SEN_5V_A2: PEDALBOX_BULKHEAD_CONN.4 ; port APPS_SENSOR1.SEN_5V, port APPS_SENSOR1_PL.SEN_5V

Not connected (* = marked no-connect by the designer): PEDALBOX_BULKHEAD_CONN 16* 17* 18* 19* 20*

### Notes on the sheet
- This is an autosport mating pair
- (near PEDALBOX_BULKHEAD_CONN) A
- (near PEDALBOX_BULKHEAD_CONN) B
- (near PEDALBOX_BULKHEAD_CONN) C
- (near PEDALBOX_BULKHEAD_CONN) D
- (near PEDALBOX_BULKHEAD_CONN) E
- (near PEDALBOX_BULKHEAD_CONN) F
- (near PEDALBOX_BULKHEAD_CONN) G
- (near PEDALBOX_BULKHEAD_CONN) H
- (near PEDALBOX_BULKHEAD_CONN) J
- (near PEDALBOX_BULKHEAD_CONN) K
- (near PEDALBOX_BULKHEAD_CONN) L
- (near PEDALBOX_BULKHEAD_CONN) M
- (near PEDALBOX_BULKHEAD_CONN) N
- (near PEDALBOX_BULKHEAD_CONN) P
- (near PEDALBOX_BULKHEAD_CONN) R
- Mating pair:
  https://www.milspecwiring.com/AS014-19SN_p_241.html
  https://www.milspecwiring.com/AS614-19PN_p_299.html
- This bulkhead is another small autosport connector
  Mating pair:
  https://www.milspecwiring.com/AS014-19SN_p_241.html
  https://www.milspecwiring.com/AS614-19PN_p_299.html
- Title
- Size:
- Date:
- A4
- Number:
- Time:
- Revision:
- Sheet
- of
- File:

### Library data of the parts
PEDALBOX_BULKHEAD_CONN = Header 20: Header, 20-Pin; LatestRevisionDate: 17-Jul-2002; LatestRevisionNote: Re-released for DXP Platform.; Publisher: Altium Limited

## Sheet UNDERLEGS_BULKHEAD.SchDoc: =DocumentName
size A4; Organization: Queen's Formula SAE; Address1: 130 Stuart St, Kingston; Address2: Ontario; Address3: Canada; Address4: K7L 2V9; DocumentNumber: 1; Revision: 0; SheetNumber: 1; SheetTotal: 1
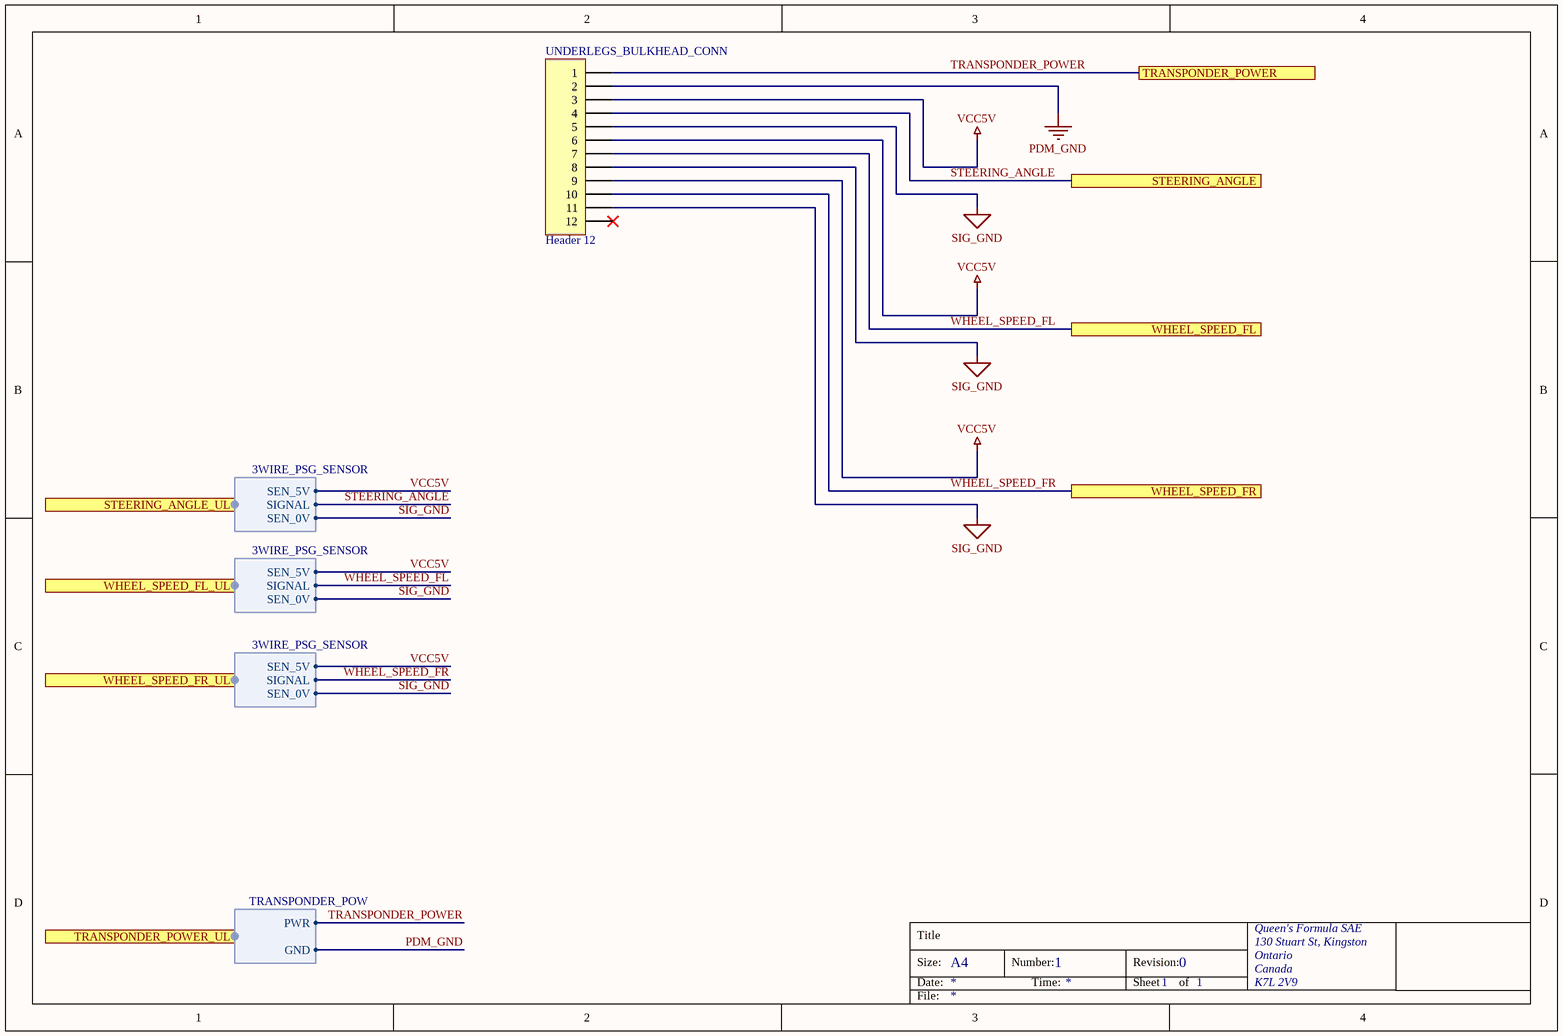
[diagram p10: UNDERLEGS_BULKHEAD.SchDoc]

### Parts
UNDERLEGS_BULKHEAD_CONN  Header 12  [HDR1X12]

### Ports
STEERING_ANGLE, STEERING_ANGLE_UL (harness 3WIRE_PSG_SENSOR), TRANSPONDER_POWER, TRANSPONDER_POWER_UL (harness TRANSPONDER_POW), WHEEL_SPEED_FL, WHEEL_SPEED_FL_UL (harness 3WIRE_PSG_SENSOR), WHEEL_SPEED_FR, WHEEL_SPEED_FR_UL (harness 3WIRE_PSG_SENSOR)

### Harnesses
3WIRE_PSG_SENSOR: SEN_5V, SEN_0V, SIGNAL
TRANSPONDER_POW: PWR, GND

### Nets
PDM_GND: UNDERLEGS_BULKHEAD_CONN.2 UNDERLEGS_BULKHEAD_CONN.5 UNDERLEGS_BULKHEAD_CONN.8 UNDERLEGS_BULKHEAD_CONN.11 ; port WHEEL_SPEED_FL_UL.SEN_0V, port WHEEL_SPEED_FR_UL.SEN_0V, port TRANSPONDER_POWER_UL.GND, port STEERING_ANGLE_UL.SEN_0V  [also labelled SIG_GND]  [project net FUEL_PRESSURE.SEN_0V]
VCC5V: UNDERLEGS_BULKHEAD_CONN.3 UNDERLEGS_BULKHEAD_CONN.6 UNDERLEGS_BULKHEAD_CONN.9 ; port WHEEL_SPEED_FL_UL.SEN_5V, port WHEEL_SPEED_FR_UL.SEN_5V, port STEERING_ANGLE_UL.SEN_5V  [project net FUEL_PRESSURE.SEN_5V]
STEERING_ANGLE: UNDERLEGS_BULKHEAD_CONN.4 ; port STEERING_ANGLE, port STEERING_ANGLE_UL.SIGNAL
TRANSPONDER_POWER: UNDERLEGS_BULKHEAD_CONN.1 ; port TRANSPONDER_POWER, port TRANSPONDER_POWER_UL.PWR
WHEEL_SPEED_FL: UNDERLEGS_BULKHEAD_CONN.7 ; port WHEEL_SPEED_FL, port WHEEL_SPEED_FL_UL.SIGNAL
WHEEL_SPEED_FR: UNDERLEGS_BULKHEAD_CONN.10 ; port WHEEL_SPEED_FR, port WHEEL_SPEED_FR_UL.SIGNAL

Not connected (* = marked no-connect by the designer): UNDERLEGS_BULKHEAD_CONN 12*

### Notes on the sheet
- Title
- Size:
- Date:
- A4
- Number:
- Time:
- Revision:
- Sheet
- of
- File:

### Library data of the parts
UNDERLEGS_BULKHEAD_CONN = Header 12: Header, 12-Pin; LatestRevisionDate: 17-Jul-2002; LatestRevisionNote: Re-released for DXP Platform.; Publisher: Altium Limited

## Sheet DASH_BULKHEAD.SchDoc: =DocumentName
size A4; Organization: Queen's Formula SAE; Address1: 130 Stuart St, Kingston; Address2: Ontario; Address3: Canada; Address4: K7L 2V9; DocumentNumber: 1; Revision: 0; SheetNumber: 1; SheetTotal: 1
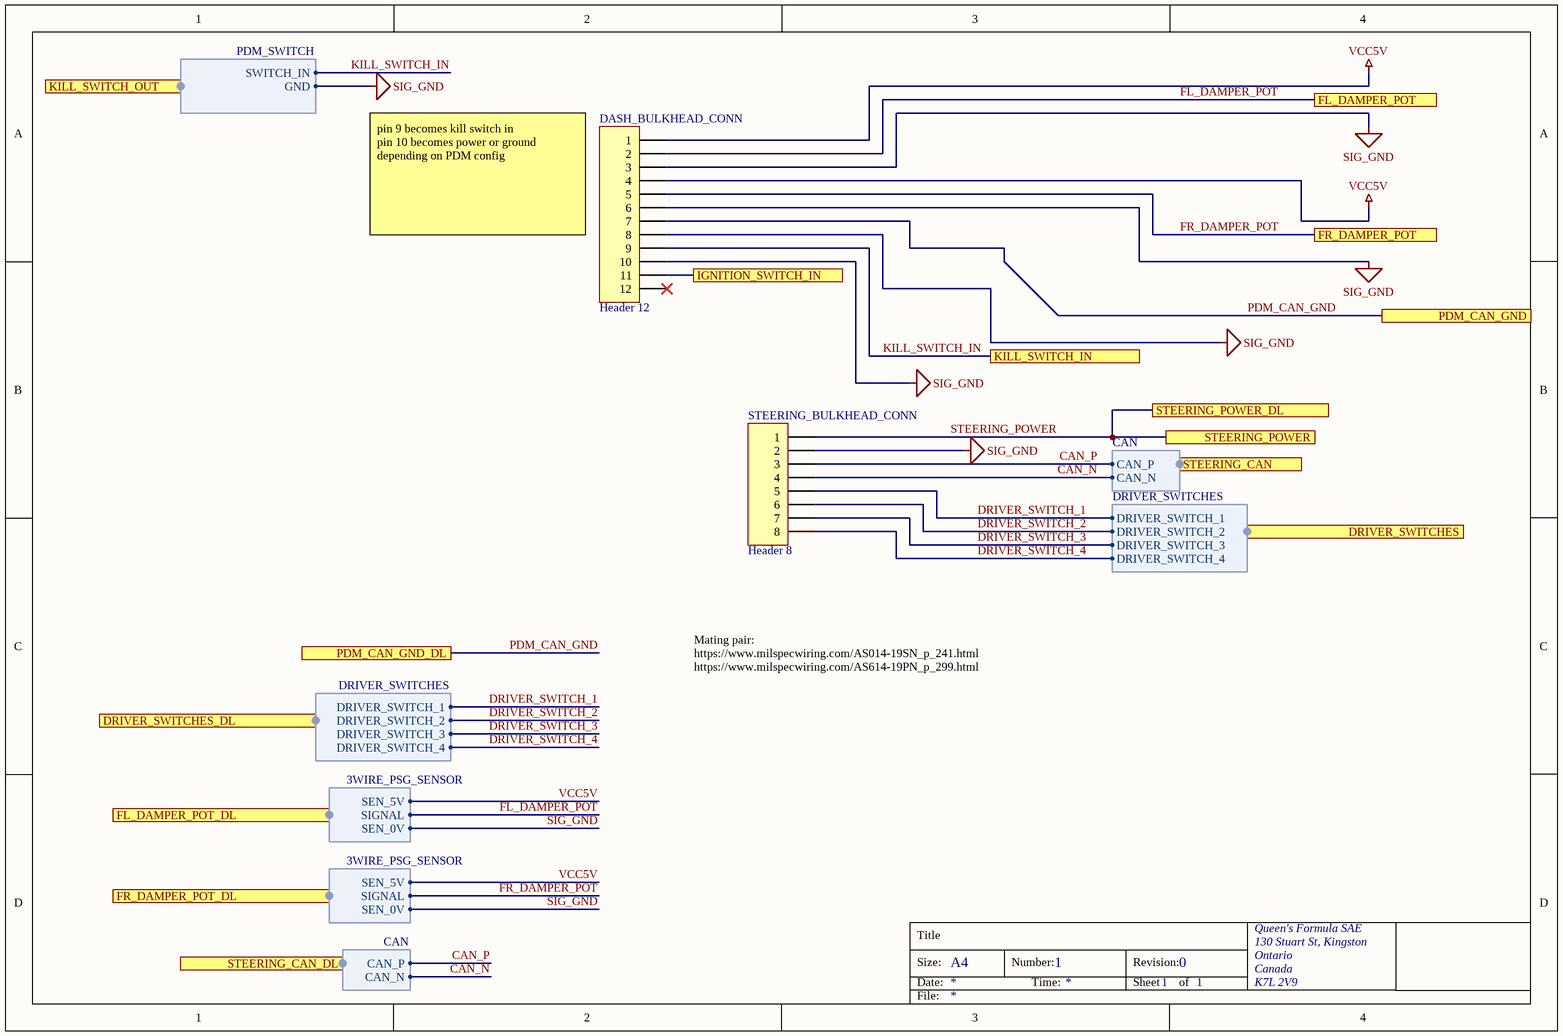
[diagram p11: DASH_BULKHEAD.SchDoc]

### Parts
DASH_BULKHEAD_CONN  Header 12  [HDR1X12]
STEERING_BULKHEAD_CONN  Header 8  [HDR1X8]

### Ports
DRIVER_SWITCHES (harness DRIVER_SWITCHES), DRIVER_SWITCHES_DL (harness DRIVER_SWITCHES), FL_DAMPER_POT, FL_DAMPER_POT_DL (harness 3WIRE_PSG_SENSOR), FR_DAMPER_POT, FR_DAMPER_POT_DL (harness 3WIRE_PSG_SENSOR), IGNITION_SWITCH_IN, KILL_SWITCH_IN, KILL_SWITCH_OUT (harness PDM_SWITCH), PDM_CAN_GND, PDM_CAN_GND_DL, STEERING_CAN (harness CAN), STEERING_CAN_DL (harness CAN), STEERING_POWER, STEERING_POWER_DL

### Harnesses
DRIVER_SWITCHES: DRIVER_SWITCH_1, DRIVER_SWITCH_2, DRIVER_SWITCH_3, DRIVER_SWITCH_4
3WIRE_PSG_SENSOR: SEN_5V, SEN_0V, SIGNAL
CAN: CAN_P, CAN_N
PDM_SWITCH: SWITCH_IN, GND

### Nets
PDM_CAN_GND: DASH_BULKHEAD_CONN.3 DASH_BULKHEAD_CONN.6 DASH_BULKHEAD_CONN.7 DASH_BULKHEAD_CONN.8 DASH_BULKHEAD_CONN.10 STEERING_BULKHEAD_CONN.2 ; port PDM_CAN_GND_DL, port PDM_CAN_GND, port FL_DAMPER_POT_DL.SEN_0V, port FR_DAMPER_POT_DL.SEN_0V, port KILL_SWITCH_OUT.GND  [also labelled SIG_GND]  [project net FUEL_PRESSURE.SEN_0V]
VCC5V: DASH_BULKHEAD_CONN.1 DASH_BULKHEAD_CONN.4 ; port FL_DAMPER_POT_DL.SEN_5V, port FR_DAMPER_POT_DL.SEN_5V  [project net FUEL_PRESSURE.SEN_5V]
CAN_N: STEERING_BULKHEAD_CONN.4 ; port STEERING_CAN_DL.CAN_N, port STEERING_CAN.CAN_N  [project net CAN.CAN_N]
CAN_P: STEERING_BULKHEAD_CONN.3 ; port STEERING_CAN_DL.CAN_P, port STEERING_CAN.CAN_P  [project net CAN.CAN_P]
DRIVER_SWITCH_1: STEERING_BULKHEAD_CONN.5 ; port DRIVER_SWITCHES_DL.DRIVER_SWITCH_1, port DRIVER_SWITCHES.DRIVER_SWITCH_1
DRIVER_SWITCH_2: STEERING_BULKHEAD_CONN.6 ; port DRIVER_SWITCHES_DL.DRIVER_SWITCH_2, port DRIVER_SWITCHES.DRIVER_SWITCH_2
DRIVER_SWITCH_3: STEERING_BULKHEAD_CONN.7 ; port DRIVER_SWITCHES_DL.DRIVER_SWITCH_3, port DRIVER_SWITCHES.DRIVER_SWITCH_3
DRIVER_SWITCH_4: STEERING_BULKHEAD_CONN.8 ; port DRIVER_SWITCHES_DL.DRIVER_SWITCH_4, port DRIVER_SWITCHES.DRIVER_SWITCH_4
FL_DAMPER_POT: DASH_BULKHEAD_CONN.2 ; port FL_DAMPER_POT, port FL_DAMPER_POT_DL.SIGNAL
FR_DAMPER_POT: DASH_BULKHEAD_CONN.5 ; port FR_DAMPER_POT, port FR_DAMPER_POT_DL.SIGNAL
IGNITION_SWITCH_IN: DASH_BULKHEAD_CONN.11 ; port IGNITION_SWITCH_IN
KILL_SWITCH_IN: DASH_BULKHEAD_CONN.9 ; port KILL_SWITCH_IN, port KILL_SWITCH_OUT.SWITCH_IN
STEERING_POWER: STEERING_BULKHEAD_CONN.1 ; port STEERING_POWER, port STEERING_POWER_DL

Not connected (* = marked no-connect by the designer): DASH_BULKHEAD_CONN 12*

### Notes on the sheet
- pin 9 becomes kill switch in
  pin 10 becomes power or ground depending on PDM config
- Mating pair:
  https://www.milspecwiring.com/AS014-19SN_p_241.html
  https://www.milspecwiring.com/AS614-19PN_p_299.html
- Title
- Size:
- Date:
- A4
- Number:
- Time:
- Revision:
- Sheet
- of
- File:

### Library data of the parts
DASH_BULKHEAD_CONN = Header 12: Header, 12-Pin; LatestRevisionDate: 17-Jul-2002; LatestRevisionNote: Re-released for DXP Platform.; Publisher: Altium Limited
STEERING_BULKHEAD_CONN = Header 8: Header, 8-Pin; LatestRevisionDate: 17-Jul-2002; LatestRevisionNote: Re-released for DXP Platform.; Publisher: Altium Limited

## Sheet BSPD.SchDoc: =DocumentName
size A4; Organization: Queen's Formula SAE; Address1: 130 Stuart St, Kingston; Address2: Ontario; Address3: Canada; Address4: K7L 2V9; DocumentNumber: 1; Revision: 0; SheetNumber: 1; SheetTotal: 1
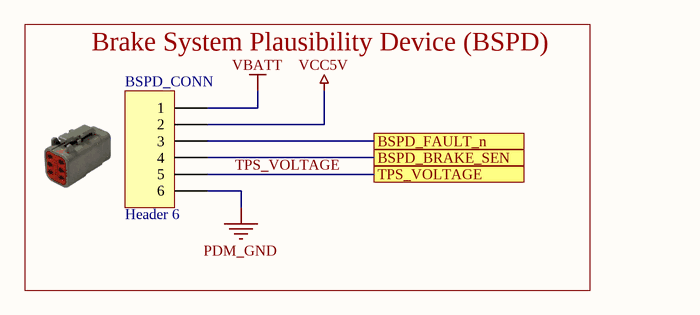
[diagram p12: BSPD.SchDoc]

### Parts
BSPD_CONN  Header 6  [HDR1X6]

### Blocks framed on the sheet
Brake System Plausibility Device (BSPD): BSPD_CONN

### Ports
BSPD_BRAKE_SEN, BSPD_FAULT_n, TPS_VOLTAGE

### Nets
PDM_GND: BSPD_CONN.6  [project net FUEL_PRESSURE.SEN_0V]
VBATT: BSPD_CONN.1
VCC5V: BSPD_CONN.2  [project net FUEL_PRESSURE.SEN_5V]
BSPD_BRAKE_SEN: BSPD_CONN.4 ; port BSPD_BRAKE_SEN
BSPD_FAULT_n: BSPD_CONN.3 ; port BSPD_FAULT_n
TPS_VOLTAGE: BSPD_CONN.5 ; port TPS_VOLTAGE

### Notes on the sheet
- Title
- Size:
- Date:
- A4
- Number:
- Time:
- Revision:
- Sheet
- of
- File:

### Library data of the parts
BSPD_CONN = Header 6: Header, 6-Pin; LatestRevisionDate: 17-Jul-2002; LatestRevisionNote: Re-released for DXP Platform.; Publisher: Altium Limited

## Sheet LEGEND.SchDoc: =DocumentName
size A4; Organization: Queen's Formula SAE; Address1: 130 Stuart St, Kingston; Address2: Ontario; Address3: Canada; Address4: K7L 2V9; DocumentNumber: 1; Revision: 0; SheetNumber: 1; SheetTotal: 1
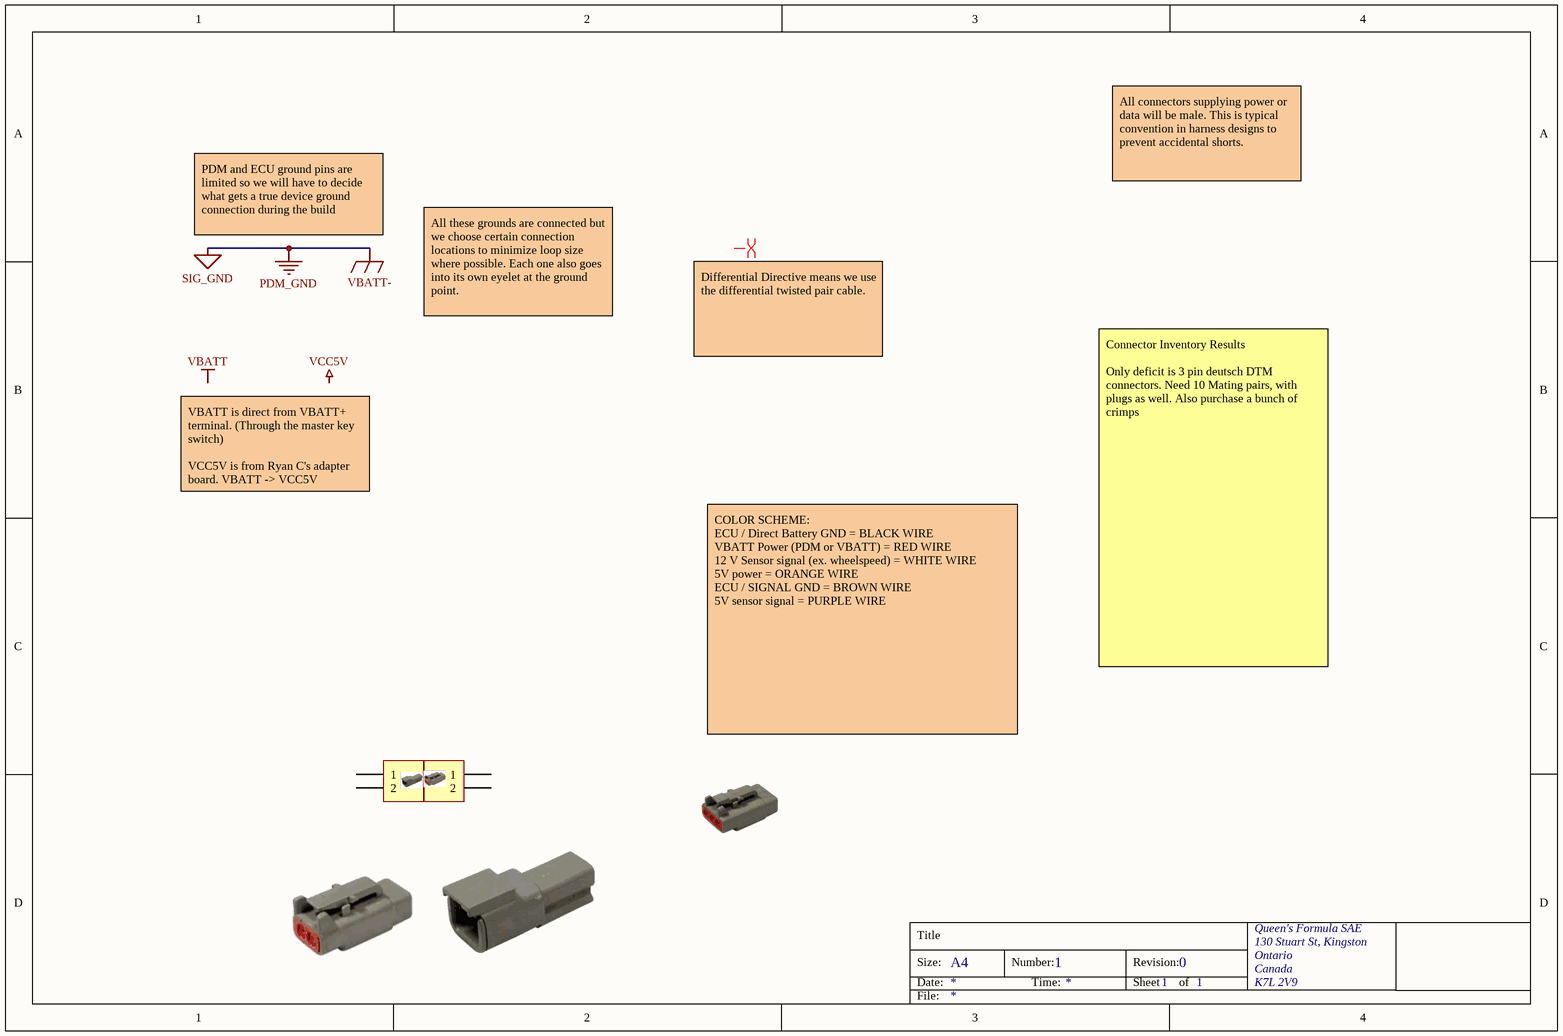
[diagram p13: LEGEND.SchDoc]

### Parts
(Parts that share a designator on the sheet are numbered #1, #2 ... from top to bottom, then left to right.)
ECU_CAN_CONNECTOR?#4  Header 2  [HDR1X2]  (value not drawn)
ECU_CAN_CONNECTOR?#5  Header 2  [HDR1X2]  (value not drawn)

### Nets

Not connected (* = marked no-connect by the designer): ECU_CAN_CONNECTOR?#4 1 2; ECU_CAN_CONNECTOR?#5 1 2

### Layout directives
differential pair: (no net found under the mark)

### Notes on the sheet
- All connectors supplying power or data will be male. This is typical convention in harness designs to prevent accidental shorts.
- PDM and ECU ground pins are limited so we will have to decide what gets a true device ground connection during the build
- All these grounds are connected but we choose certain connection locations to minimize loop size where possible. Each one also goes into its own eyelet at the ground point.
- Differential Directive means we use the differential twisted pair cable.
- VBATT is direct from VBATT+ terminal. (Through the master key switch)
  VCC5V is from Ryan C's adapter board. VBATT -> VCC5V regulator
- Connector Inventory Results
  Only deficit is 3 pin deutsch DTM connectors. Need 10 Mating pairs, with plugs as well. Also purchase a bunch of crimps
- COLOR SCHEME:
  ECU / Direct Battery GND = BLACK WIRE
  VBATT Power (PDM or VBATT) = RED WIRE
  12 V Sensor signal (ex. wheelspeed) = WHITE WIRE
  5V power = ORANGE WIRE
  ECU / SIGNAL GND = BROWN WIRE
  5V sensor signal = PURPLE WIRE
- Labels drawn without touching a wire or pin: VBATT, VCC5V
- Title
- Size:
- Date:
- A4
- Number:
- Time:
- Revision:
- Sheet
- of
- File:

### Library data of the parts
ECU_CAN_CONNECTOR?#4 ECU_CAN_CONNECTOR?#5 = Header 2: Header, 2-Pin; LatestRevisionDate: 17-Jul-2002; LatestRevisionNote: Re-released for DXP Platform.; Publisher: Altium Limited

## Nets that join several sheets
FUEL_PRESSURE.SEN_0V: Dash Area (5 pins), Pedalbox (APPS_CONN2.3 BRAKE_OT_CONN.2 FRONT_BR_PRES?.3 REAR_BR_PRES?.3), Under Legs (STEERING_ANGLE_SEN_CONN.3 TRANSPONDER_CONN.2 WHEEL_SPEED_FL_CONN.3 WHEEL_SPEED_FR_CONN.3), ECU (5 pins), Engine Bay and Rear Tube (14 pins), PDM (PDM_CONN_A.28 PDM_CONN_B.22), Data Logger (DATA_LOGGER_CONN.7), REAR_LOOM_BULKHEAD (14 pins), PEDALBOX_BULKHEAD (5 pins), UNDERLEGS_BULKHEAD (UNDERLEGS_BULKHEAD_CONN.2 UNDERLEGS_BULKHEAD_CONN.5 UNDERLEGS_BULKHEAD_CONN.8 UNDERLEGS_BULKHEAD_CONN.11), DASH_BULKHEAD (6 pins), BSPD (BSPD_CONN.6)
FUEL_PRESSURE.SEN_5V: Dash Area (FL_DAMPER_CONN.1 FR_DAMPER_CONN.1), Pedalbox (APPS_CONN2.1 FRONT_BR_PRES?.1 REAR_BR_PRES?.1), Under Legs (STEERING_ANGLE_SEN_CONN.1 WHEEL_SPEED_FL_CONN.1 WHEEL_SPEED_FR_CONN.1), ECU (ECU_CONN_B.26), Engine Bay and Rear Tube (6 pins), REAR_LOOM_BULKHEAD (6 pins), PEDALBOX_BULKHEAD (PEDALBOX_BULKHEAD_CONN.1 PEDALBOX_BULKHEAD_CONN.10 PEDALBOX_BULKHEAD_CONN.13), UNDERLEGS_BULKHEAD (UNDERLEGS_BULKHEAD_CONN.3 UNDERLEGS_BULKHEAD_CONN.6 UNDERLEGS_BULKHEAD_CONN.9), DASH_BULKHEAD (DASH_BULKHEAD_CONN.1 DASH_BULKHEAD_CONN.4), BSPD (BSPD_CONN.2)
VBATT: TOP (ECU_CAN_CONNECTOR?#2.1), Pedalbox (R2.2), BSPD (BSPD_CONN.1)
APPS1_VOLTAGE: Pedalbox (APPS_CONN1.2), ECU (ECU_CONN_C.15), PEDALBOX_BULKHEAD (PEDALBOX_BULKHEAD_CONN.5)
APPS2_VOLTAGE: Pedalbox (APPS_CONN2.2), ECU (ECU_CONN_B.16), PEDALBOX_BULKHEAD (PEDALBOX_BULKHEAD_CONN.2)
BOOST_ACT_OUT: ECU (ECU_CONN_B.21), Engine Bay and Rear Tube (TURBO_CONN.3), REAR_LOOM_BULKHEAD (REAR_LOOM_CONN#1.32)
BRAKE_LIGHT: Engine Bay and Rear Tube (BRAKE_LIGHT_CONN.2), PDM (PDM_CONN_A.7), REAR_LOOM_BULKHEAD (REAR_WHEEL_BULK.13)
BRAKE_OT_n: Pedalbox (BRAKE_OT_CONN.1 R2.1), PDM (PDM_CONN_B.21), PEDALBOX_BULKHEAD (PEDALBOX_BULKHEAD_CONN.9)
BSPD_BRAKE_SEN: Pedalbox (FRONT_BR_PRES?.2), ECU (ECU_CONN_B.10), PEDALBOX_BULKHEAD (PEDALBOX_BULKHEAD_CONN.11), BSPD (BSPD_CONN.4)
BSPD_FAULT_n: PDM (PDM_CONN_B.20), BSPD (BSPD_CONN.3)
CAN.CAN_N: Dash Area (P?.4 STEERING_QUICK_CONN.4), ECU (ECU_CAN_CONNECTOR?#3.2), Engine Bay and Rear Tube (LAMBDA_SEN_CONN.2), PDM (PDM_CAN_CONN#2.2), Data Logger (DATALOGGER_CAN_CONN.2), REAR_LOOM_BULKHEAD (REAR_LOOM_CONN#1.22), DASH_BULKHEAD (STEERING_BULKHEAD_CONN.4)
CAN.CAN_P: Dash Area (P?.5 STEERING_QUICK_CONN.3), ECU (ECU_CAN_CONNECTOR?#3.1), Engine Bay and Rear Tube (LAMBDA_SEN_CONN.3), PDM (PDM_CAN_CONN#2.1), Data Logger (DATALOGGER_CAN_CONN.1), REAR_LOOM_BULKHEAD (REAR_LOOM_CONN#1.20), DASH_BULKHEAD (STEERING_BULKHEAD_CONN.3)
COOLANT_TEMP: ECU (ECU_CONN_A.1), Engine Bay and Rear Tube (COOLANT_TEMP_CONN.1), REAR_LOOM_BULKHEAD (REAR_LOOM_CONN#1.9)
COOLING_FAN_POWER: Engine Bay and Rear Tube (FAN_CONN.2 FAN_CONN?.2), PDM (PDM_CONN_A.15), REAR_LOOM_BULKHEAD (REAR_LOOM_CONN#1.49 REAR_LOOM_CONN#2.31)
CYLINDER_KNOCK: ECU (ECU_CONN_D.7), Engine Bay and Rear Tube (KNOCK_CONN.2), REAR_LOOM_BULKHEAD (REAR_LOOM_CONN#1.1)
DATA_LOGGER_VBATT: PDM (PDM_CONN_A.9 PDM_CONN_A.17), Data Logger (DATA_LOGGER_CONN.8)
DRIVER_SWITCH_1: Dash Area (STEERING_QUICK_CONN.5), ECU (ECU_CONN_D.2), DASH_BULKHEAD (STEERING_BULKHEAD_CONN.5)
DRIVER_SWITCH_2: Dash Area (STEERING_QUICK_CONN.6), ECU (ECU_CONN_D.8), DASH_BULKHEAD (STEERING_BULKHEAD_CONN.6)
DRIVER_SWITCH_3: Dash Area (STEERING_QUICK_CONN.7), ECU (ECU_CONN_D.9), DASH_BULKHEAD (STEERING_BULKHEAD_CONN.7)
DRIVER_SWITCH_4: Dash Area (STEERING_QUICK_CONN.8), ECU (ECU_CONN_D.10), DASH_BULKHEAD (STEERING_BULKHEAD_CONN.8)
ECU_VBATT: ECU (ECU_CONN_B.13 ECU_CONN_B.19 ECU_CONN_C.26), PDM (6 pins)
ENGINE_SPEED_IN: ECU (ECU_CONN_D.1), Engine Bay and Rear Tube (ENGINE_SPEED_CONN.2), REAR_LOOM_BULKHEAD (REAR_LOOM_CONN#1.45)
ENGINE_SYNC_CAM_IN: ECU (ECU_CONN_D.14), Engine Bay and Rear Tube (ENGINE_CAM_SEN_CONN.2), REAR_LOOM_BULKHEAD (REAR_LOOM_CONN#1.39)
FL_DAMPER_POT: Data Logger (DATA_LOGGER_CONN.22), DASH_BULKHEAD (DASH_BULKHEAD_CONN.2)
FR_DAMPER_POT: Data Logger (DATA_LOGGER_CONN.21), DASH_BULKHEAD (DASH_BULKHEAD_CONN.5)
FUEL_COMP_VOLTAGE: ECU (ECU_CONN_D.11), Engine Bay and Rear Tube (FUEL_COMP_SEN_CONN.2), REAR_LOOM_BULKHEAD (REAR_LOOM_CONN#1.33)
FUEL_INJECTOR_POWER: Engine Bay and Rear Tube (INJECTOR_CONN.1 INJECTOR_CONN.2), PDM (PDM_CONN_A.4), REAR_LOOM_BULKHEAD (REAR_LOOM_CONN#2.1)
FUEL_PRES_SEN: ECU (ECU_CONN_C.25), Engine Bay and Rear Tube (FUEL_PRES_CONN.2), REAR_LOOM_BULKHEAD (REAR_LOOM_CONN#1.16)
FUEL_PUMP_POWER: Engine Bay and Rear Tube (FUEL_PUMP_CONN.1 FUEL_PUMP_CONN.2), PDM (PDM_CONN_A.3 PDM_CONN_A.12), REAR_LOOM_BULKHEAD (REAR_LOOM_CONN#2.21 REAR_LOOM_CONN#2.23)
GEAR_POS_SIG: ECU (ECU_CONN_D.21), Engine Bay and Rear Tube (GEAR_POS_CONN.2), PDM (PDM_CONN_B.24), REAR_LOOM_BULKHEAD (REAR_LOOM_CONN#1.4)
GEAR_SHIFT_ACTUATOR_PRESSURE: ECU (ECU_CONN_C.14), Engine Bay and Rear Tube (GEAR_SHIFT_ACT_PRESSURE_CONN.2), REAR_LOOM_BULKHEAD (REAR_LOOM_CONN#1.15)
GEAR_SHIFT_DOWN_CTRL: ECU (ECU_CONN_C.33), Engine Bay and Rear Tube (GEAR_SHIFT_ACT_CONN.3), REAR_LOOM_BULKHEAD (REAR_LOOM_CONN#1.40)
GEAR_SHIFT_UP_CTRL: ECU (ECU_CONN_C.32), Engine Bay and Rear Tube (GEAR_SHIFT_ACT_CONN.1), REAR_LOOM_BULKHEAD (REAR_LOOM_CONN#1.36)
IGNITION_COIL_POWER: Engine Bay and Rear Tube (IGNITION_CONN.1 IGNITION_CONN.2), PDM (PDM_CONN_A.1 PDM_CONN_A.10), REAR_LOOM_BULKHEAD (REAR_LOOM_CONN#2.11 REAR_LOOM_CONN#2.13)
IGNITION_CTRL_OUT: ECU (ECU_CONN_C.4), Engine Bay and Rear Tube (IGNITION_CONN.3), REAR_LOOM_BULKHEAD (REAR_LOOM_CONN#2.15)
IGNITION_SEN_0V: ECU (ECU_CONN_D.16), Engine Bay and Rear Tube (GEAR_SHIFT_ACT_PRESSURE_CONN.3 IGNITION_CONN.5), REAR_LOOM_BULKHEAD (REAR_LOOM_CONN#1.17 REAR_LOOM_CONN#2.29)
IGNITION_SWITCH_IN: PDM (PDM_CONN_A.27), DASH_BULKHEAD (DASH_BULKHEAD_CONN.11)
INJECTOR_CTRL_OUT: ECU (ECU_CONN_C.23), Engine Bay and Rear Tube (INJECTOR_CONN.3), REAR_LOOM_BULKHEAD (REAR_LOOM_CONN#2.5)
INLET_AIR_TEMP: ECU (ECU_CONN_D.3), Engine Bay and Rear Tube (INLET_TEMP_CONN.1), REAR_LOOM_BULKHEAD (REAR_LOOM_CONN#1.5)
INLET_MAN_PRESS_SEN: Engine Bay and Rear Tube (INLET_MANI_PRESSURE_CONN.2), REAR_LOOM_BULKHEAD (REAR_LOOM_CONN#1.46)
KILL_SWITCH_IN: Dash Area (KILL_SWITCH_CONN.1), PDM (PDM_CONN_A.19), DASH_BULKHEAD (DASH_BULKHEAD_CONN.9)
LAMBDA_LTC_POWER: Engine Bay and Rear Tube (LAMBDA_SEN_CONN.4), PDM (PDM_CONN_A.11), REAR_LOOM_BULKHEAD (REAR_LOOM_CONN#1.24)
OIL_PRESSURE_SWITCH: ECU (ECU_CONN_A.2), Engine Bay and Rear Tube (OIL_PRESSURE_CONN.1), REAR_LOOM_BULKHEAD (REAR_LOOM_CONN#1.3)
PDM_GND: Engine Bay and Rear Tube (9 pins), REAR_LOOM_BULKHEAD (8 pins)
REAR_BR_PRES: Pedalbox (REAR_BR_PRES?.2), ECU (ECU_CONN_B.11), PEDALBOX_BULKHEAD (PEDALBOX_BULKHEAD_CONN.14)
REAR_WS_POWER: PDM (PDM_CONN_A.16), REAR_LOOM_BULKHEAD (REAR_WHEEL_BULK.7 REAR_WHEEL_BULK.10)
RL_DAMPER_POT: Engine Bay and Rear Tube (RL_DAMP_CONN.2), Data Logger (DATA_LOGGER_CONN.19), REAR_LOOM_BULKHEAD (REAR_WHEEL_BULK.2)
RR_DAMPER_POT: Engine Bay and Rear Tube (RR_DAMP_CONN.2), Data Logger (DATA_LOGGER_CONN.20), REAR_LOOM_BULKHEAD (REAR_WHEEL_BULK.5)
SEN_0V_A: ECU (ECU_CONN_D.15), Engine Bay and Rear Tube (INLET_TEMP_CONN.2), REAR_LOOM_BULKHEAD (REAR_LOOM_CONN#1.7)
SEN_0V_A1: Pedalbox (APPS_CONN1.3), ECU (ECU_CONN_A.34), PEDALBOX_BULKHEAD (PEDALBOX_BULKHEAD_CONN.6)
SEN_0V_B1: ECU (ECU_CONN_A.33), Engine Bay and Rear Tube (FUEL_COMP_SEN_CONN.3), REAR_LOOM_BULKHEAD (REAR_LOOM_CONN#1.35)
SEN_0V_C1: ECU (ECU_CONN_A.26), Engine Bay and Rear Tube (COOLANT_TEMP_CONN.2), REAR_LOOM_BULKHEAD (REAR_LOOM_CONN#1.11)
SEN_0V_C2: ECU (ECU_CONN_A.27), Engine Bay and Rear Tube (THROTTLE_BODY_CONN.2), REAR_LOOM_BULKHEAD (REAR_LOOM_CONN#1.21)
SEN_5V_A2: Pedalbox (APPS_CONN1.1), ECU (ECU_CONN_C.2), PEDALBOX_BULKHEAD (PEDALBOX_BULKHEAD_CONN.4)
SEN_5V_B: ECU (ECU_CONN_C.9), Engine Bay and Rear Tube (GEAR_SHIFT_ACT_PRESSURE_CONN.1), REAR_LOOM_BULKHEAD (REAR_LOOM_CONN#1.13)
SEN_5V_B2: ECU (ECU_CONN_A.19), Engine Bay and Rear Tube (ENGINE_CAM_SEN_CONN.1), REAR_LOOM_BULKHEAD (REAR_LOOM_CONN#1.37)
SEN_5V_C1: ECU (ECU_CONN_A.10), Engine Bay and Rear Tube (FUEL_COMP_SEN_CONN.1), REAR_LOOM_BULKHEAD (REAR_LOOM_CONN#1.31)
SEN_5V_C2: ECU (ECU_CONN_A.18), Engine Bay and Rear Tube (ENGINE_SPEED_CONN.1), REAR_LOOM_BULKHEAD (REAR_LOOM_CONN#1.43)
STARTER_RELAY_CTRL: Engine Bay and Rear Tube (STARTER_RELAY_CONN.1), PDM (PDM_CONN_A.2)
STEERING_ANGLE: Under Legs (STEERING_ANGLE_SEN_CONN.2), Data Logger (DATA_LOGGER_CONN.3), UNDERLEGS_BULKHEAD (UNDERLEGS_BULKHEAD_CONN.4)
STEERING_POWER: Dash Area (STEERING_QUICK_CONN.1), PDM (PDM_CONN_A.8), DASH_BULKHEAD (STEERING_BULKHEAD_CONN.1)
TB_MOTOR+: ECU (ECU_CONN_C.1), Engine Bay and Rear Tube (THROTTLE_BODY_CONN.4), REAR_LOOM_BULKHEAD (REAR_LOOM_CONN#1.25)
TB_MOTOR-: ECU (ECU_CONN_C.18), Engine Bay and Rear Tube (THROTTLE_BODY_CONN.1), REAR_LOOM_BULKHEAD (REAR_LOOM_CONN#1.19)
TPS_TRACKING_VOLTAGE: ECU (ECU_CONN_C.17), Engine Bay and Rear Tube (THROTTLE_BODY_CONN.6), REAR_LOOM_BULKHEAD (REAR_LOOM_CONN#1.29)
TPS_VOLTAGE: ECU (ECU_CONN_C.16), Engine Bay and Rear Tube (THROTTLE_BODY_CONN.5), REAR_LOOM_BULKHEAD (REAR_LOOM_CONN#1.27), BSPD (BSPD_CONN.5)
TRANSPONDER_POWER: Under Legs (TRANSPONDER_CONN.1), PDM (PDM_CONN_A.5), UNDERLEGS_BULKHEAD (UNDERLEGS_BULKHEAD_CONN.1)
TURBO_ACT_BYP: ECU (ECU_CONN_C.34), Engine Bay and Rear Tube (TURBO_CONN.1), REAR_LOOM_BULKHEAD (REAR_LOOM_CONN#1.28)
WHEEL_SPEED_BL: ECU (ECU_CONN_B.5), Engine Bay and Rear Tube (WHEEL_SPEED_BL_CONN.2), REAR_LOOM_BULKHEAD (REAR_WHEEL_BULK.8)
WHEEL_SPEED_BR: ECU (ECU_CONN_B.6), Engine Bay and Rear Tube (WHEEL_SPEED_BR_CONN.2), REAR_LOOM_BULKHEAD (REAR_WHEEL_BULK.11)
WHEEL_SPEED_FL: Under Legs (WHEEL_SPEED_FL_CONN.2), ECU (ECU_CONN_B.3), UNDERLEGS_BULKHEAD (UNDERLEGS_BULKHEAD_CONN.7)
WHEEL_SPEED_FR: Under Legs (WHEEL_SPEED_FR_CONN.2), ECU (ECU_CONN_B.4), UNDERLEGS_BULKHEAD (UNDERLEGS_BULKHEAD_CONN.10)